# EAGLE design Iridium_9603_Beacon_V5M (EAGLE 9.2.2)

## Sheet 1 of 8
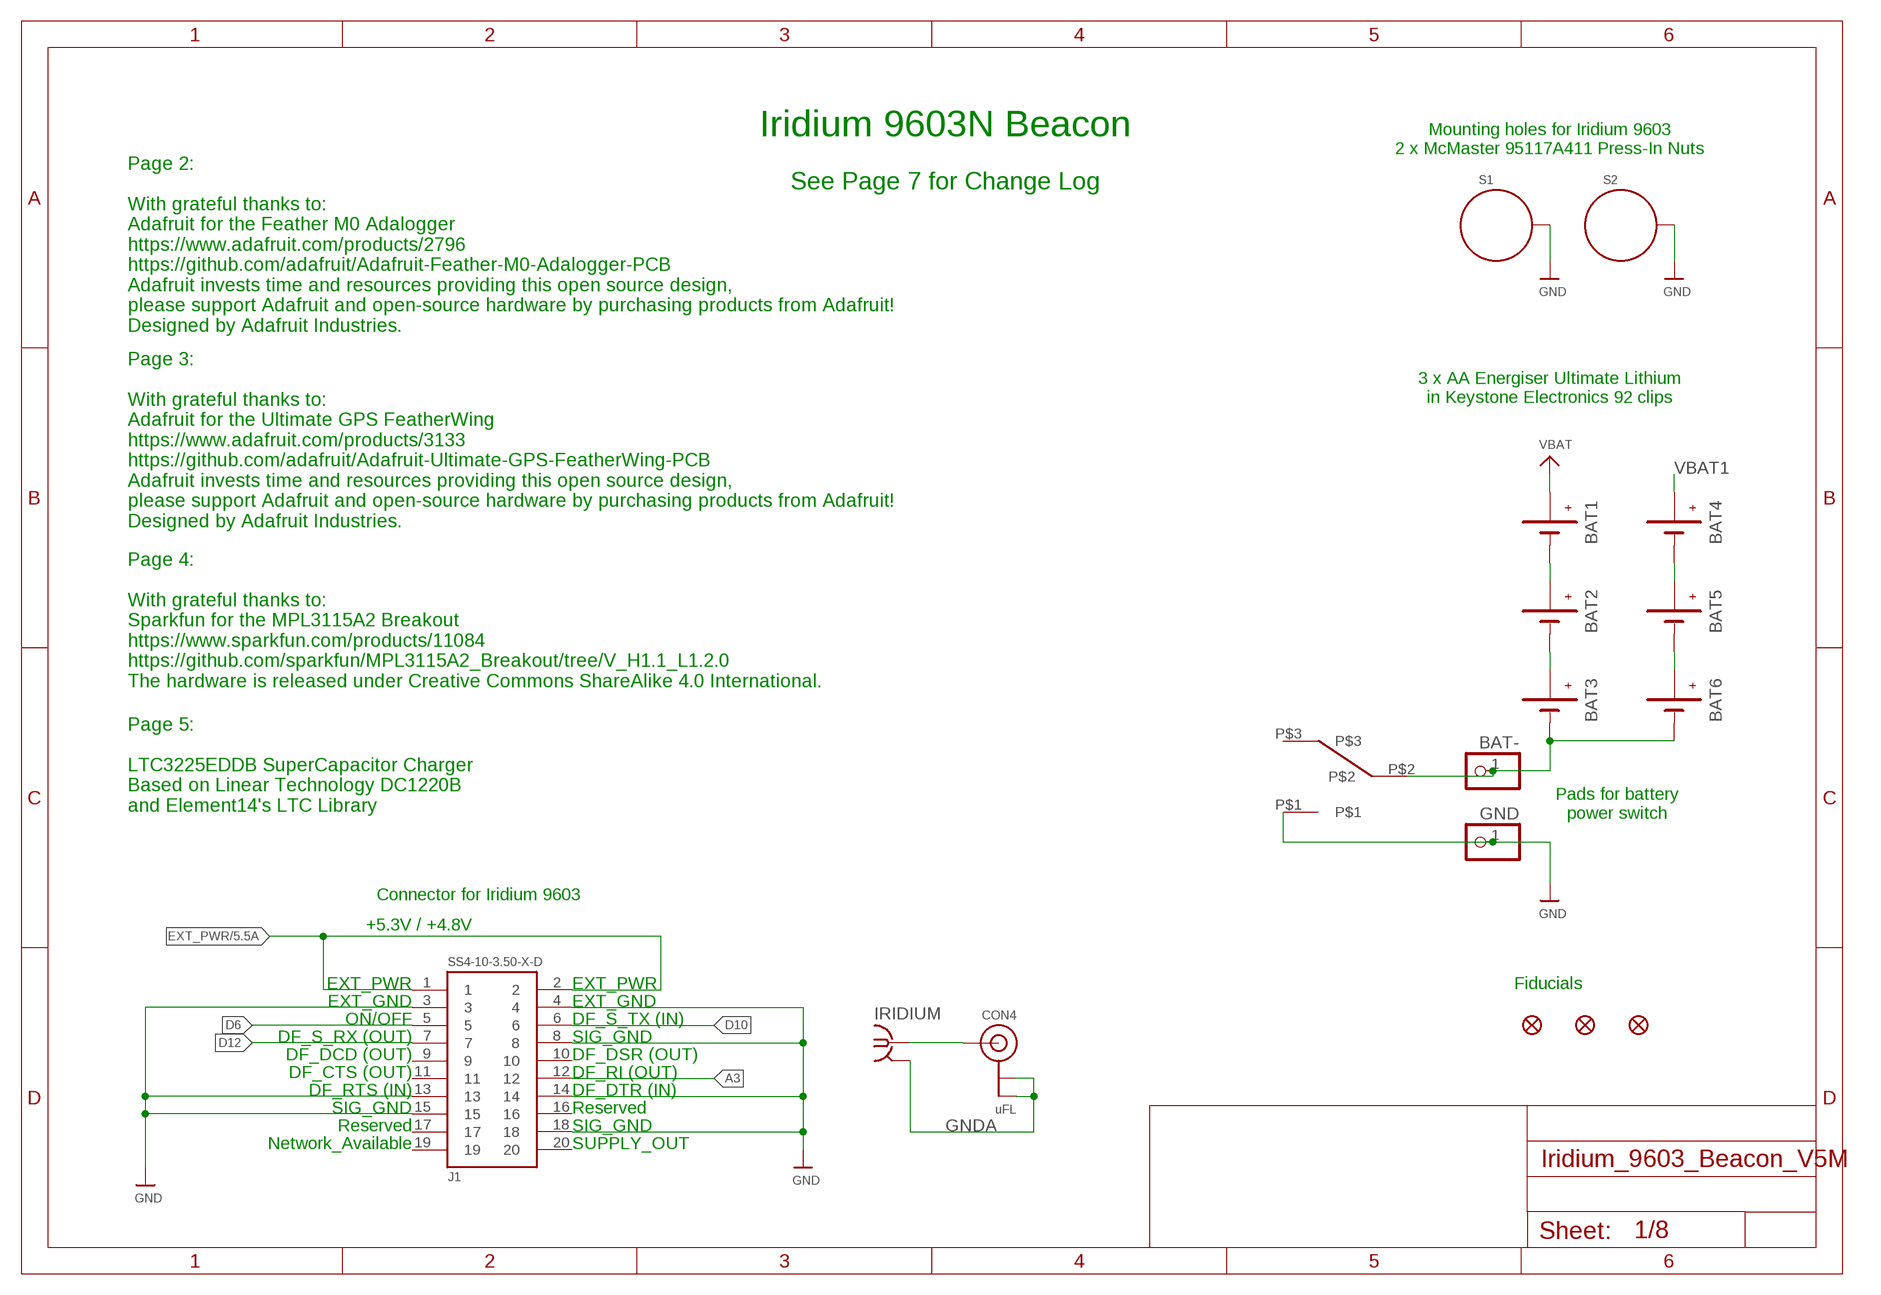
[diagram p0: schematic, sheet 1]

### Parts
BAT1  BATTERYKEYSTONE92  [BATTERY-AAA-KEYSTONE92]
BAT2  BATTERYKEYSTONE92  [BATTERY-AAA-KEYSTONE92]
BAT3  BATTERYKEYSTONE92  [BATTERY-AAA-KEYSTONE92]
BAT4  BATTERYKEYSTONE92  [BATTERY-AAA-KEYSTONE92]
BAT5  BATTERYKEYSTONE92  [BATTERY-AAA-KEYSTONE92]
BAT6  BATTERYKEYSTONE92  [BATTERY-AAA-KEYSTONE92]
BAT-  PINHD-1X1  [1X01]
CON4  uFL  ANTENNA_U.FL  [U.FL]
FD1  FIDUCIAL1X2  [FIDUCIAL-1X2]
FD2  FIDUCIAL1X2  [FIDUCIAL-1X2]
FD3  FIDUCIAL1X2  [FIDUCIAL-1X2]
GND  PINHD-1X1  [1X01]
IRIDIUM  SMA-142-0711-821/826  [J502-ND-142-0711-821/826]
J1  SS4-10-3.50-X-D  [SS4-10-3.50-X-D]
S1  STANDOFF_ELECTRICALMCMASTER-95117A411  [STANDOFF-ELECTRICAL-MCMASTER-95117A411]
S2  STANDOFF_ELECTRICALMCMASTER-95117A411  [STANDOFF-ELECTRICAL-MCMASTER-95117A411]
U53  7101K2AV2QE  [AV2_SPDT]

### Nets
A3: J1.12 ; also sheet 2
D6: J1.5 ; also sheet 2
D10: J1.6 ; also sheet 2
D12: J1.7 ; also sheet 2
EXT_PWR: J1.1 J1.2 ; also sheet 5
GND: GND.1 J1.3 J1.4 J1.8 J1.13 J1.14 J1.15 J1.18 S1.P1 S2.P1 U53.P$1 ; also sheet 2,3,4,5,6
GNDA: CON4.1(GND) CON4.2(GND) IRIDIUM.G@1 IRIDIUM.G@2 IRIDIUM.G@3 IRIDIUM.G@4
N$2: CON4.3(SIGNAL) IRIDIUM.1
N$8: BAT1.GND@1(-) BAT1.GND@2(-) BAT2.PWR@1(+) BAT2.PWR@2(+)
N$15: BAT3.GND@1(-) BAT3.GND@2(-) BAT6.GND@1(-) BAT6.GND@2(-) BAT-.1 U53.P$2
N$21: BAT2.GND@1(-) BAT2.GND@2(-) BAT3.PWR@1(+) BAT3.PWR@2(+)
N$22: BAT4.GND@1(-) BAT4.GND@2(-) BAT5.PWR@1(+) BAT5.PWR@2(+)
N$29: BAT5.GND@1(-) BAT5.GND@2(-) BAT6.PWR@1(+) BAT6.PWR@2(+)
VBAT: BAT1.PWR@1(+) BAT1.PWR@2(+) ; also sheet 2
VBAT1: BAT4.PWR@1(+) BAT4.PWR@2(+) ; also sheet 2
Unconnected: J1.9 J1.10 J1.11 J1.16 J1.17 J1.19 J1.20 U53.P$3

### Notes on the sheet
- Iridium 9603N Beacon
- Mounting holes for Iridium 9603
  2 x McMaster 95117A411 Press-In Nuts
- See Page 7 for Change Log
- Page 2:
  
  With grateful thanks to:
  Adafruit for the Feather M0 Adalogger
  https://www.adafruit.com/products/2796
  https://github.com/adafruit/Adafruit-Feather-M0-Adalogger-PCB
  Adafruit invests time and resources providing this open source design,
  please support Adafruit and open-source hardware by purchasing products from Adafruit!
  Designed by Adafruit Industries.
- 3 x AA Energiser Ultimate Lithium
  in Keystone Electronics 92 clips
- Page 3:
  
  With grateful thanks to:
  Adafruit for the Ultimate GPS FeatherWing
  https://www.adafruit.com/products/3133
  https://github.com/adafruit/Adafruit-Ultimate-GPS-FeatherWing-PCB
  Adafruit invests time and resources providing this open source design,
  please support Adafruit and open-source hardware by purchasing products from Adafruit!
  Designed by Adafruit Industries.
- Page 4:
  
  With grateful thanks to:
  Sparkfun for the MPL3115A2 Breakout
  https://www.sparkfun.com/products/11084
  https://github.com/sparkfun/MPL3115A2_Breakout/tree/V_H1.1_L1.2.0
  The hardware is released under Creative Commons ShareAlike 4.0 International.
- Page 5:
  
  LTC3225EDDB SuperCapacitor Charger
  Based on Linear Technology DC1220B
  and Element14's LTC Library
- Pads for battery
  power switch
- Connector for Iridium 9603
- +5.3V / +4.8V
- EXT_PWR | EXT_PWR | Fiducials
- EXT_GND | EXT_GND
- ON/OFF | DF_S_TX (IN)
- DF_S_RX (OUT) | SIG_GND
- DF_DCD (OUT) | DF_DSR (OUT)
- DF_CTS (OUT) | DF_RI (OUT)
- DF_RTS (IN) | DF_DTR (IN)
- SIG_GND | Reserved
- Reserved | SIG_GND
- Network_Available | SUPPLY_OUT

## Sheet 2 of 8
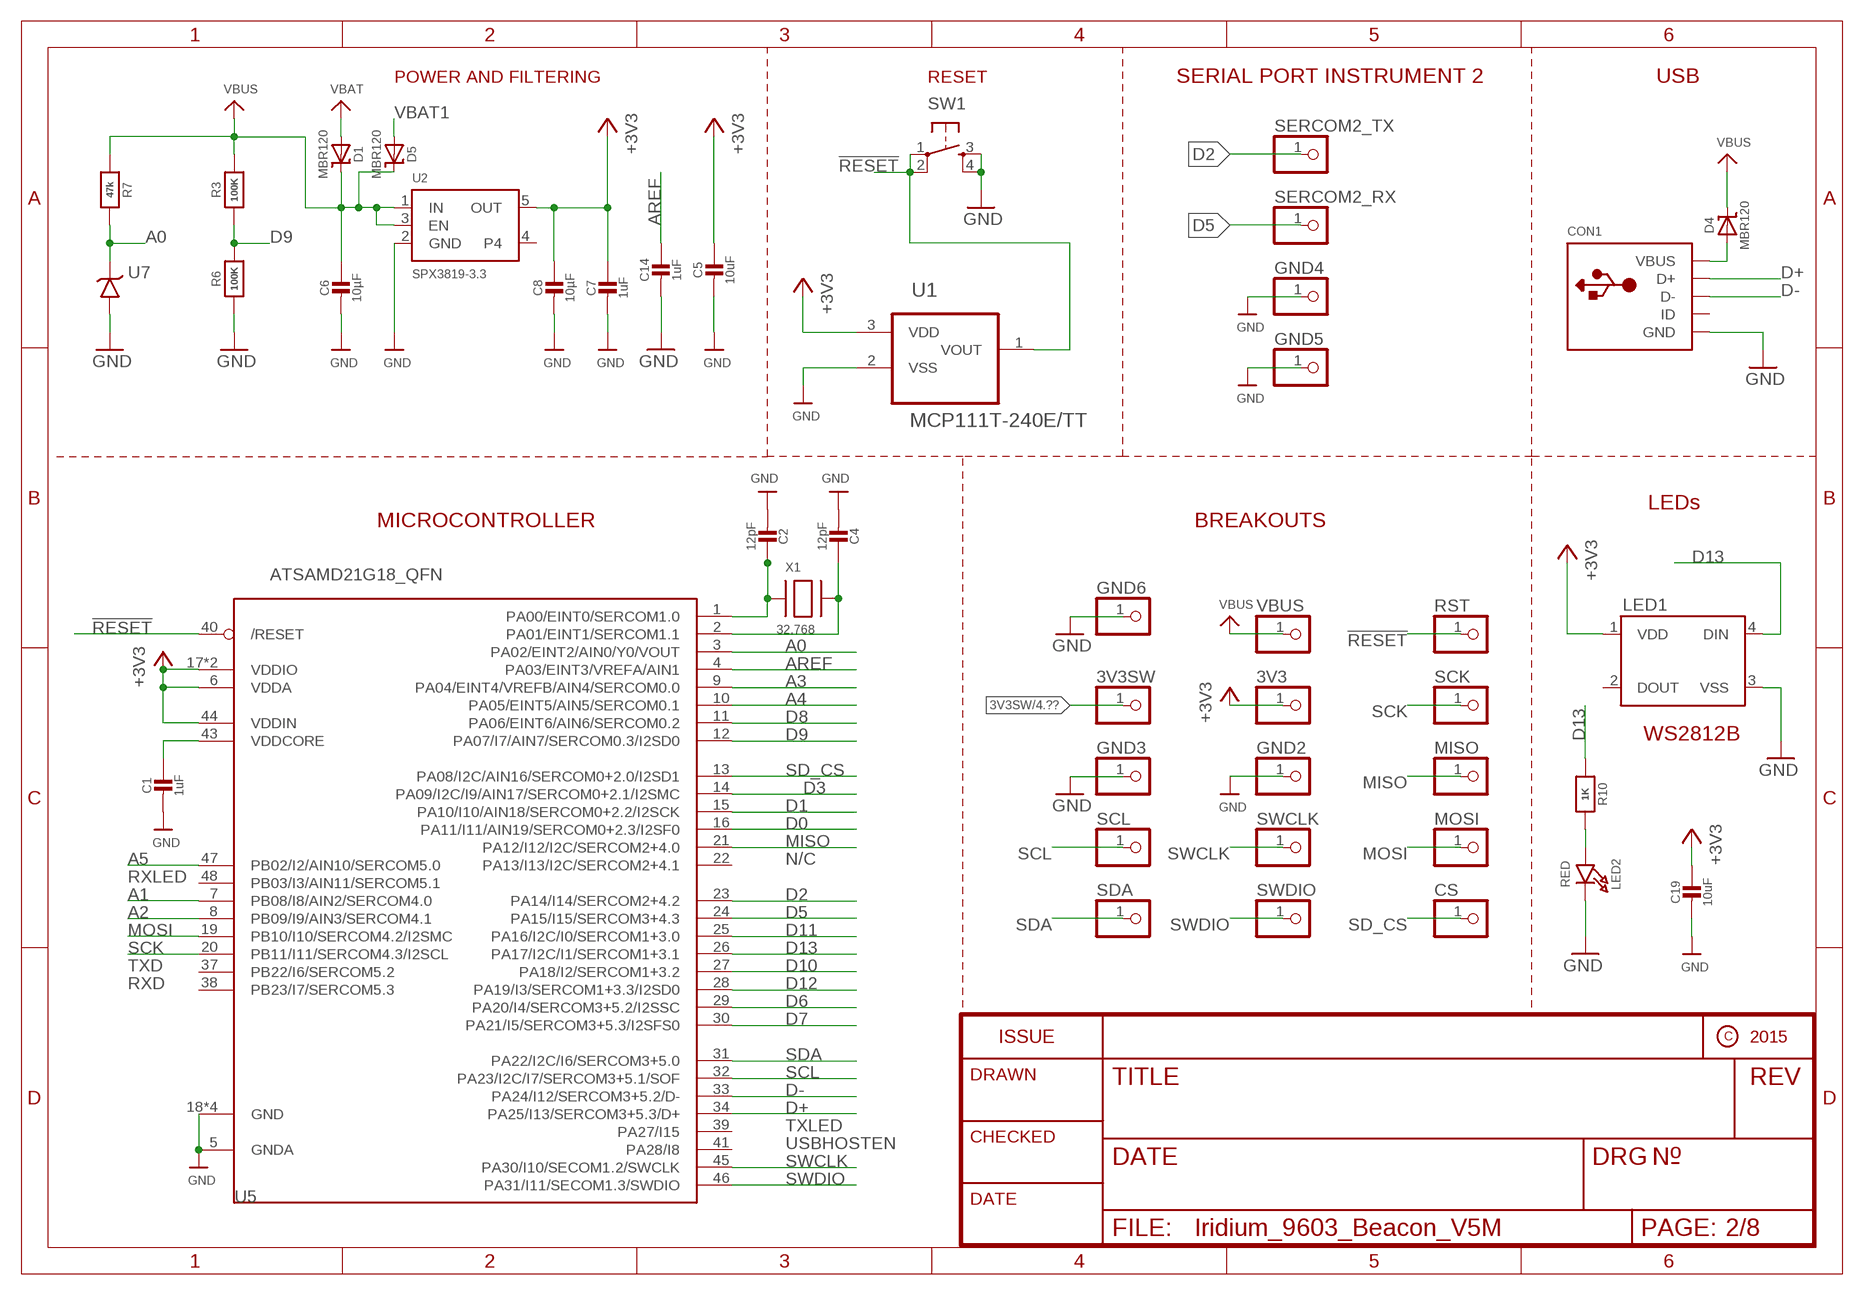
[diagram p1: schematic, sheet 2]

### Parts
3V3  PINHD-1X1  [1X01]
3V3SW  PINHD-1X1  [1X01]
C1  1uF  CAP_CERAMIC0603_NO  [0603-NO]
C2  12pF  CAP_CERAMIC0603_NO  [0603-NO]
C4  12pF  CAP_CERAMIC0603_NO  [0603-NO]
C5  10uF  CAP_CERAMIC0805-NOOUTLINE  [0805-NO]
C6  10µF  CAP_CERAMIC0805-NOOUTLINE  [0805-NO]
C7  1uF  CAP_CERAMIC0603_NO  [0603-NO]
C8  10µF  CAP_CERAMIC0805-NOOUTLINE  [0805-NO]
C14  1uF  CAP_CERAMIC0603_NO  [0603-NO]
C19  10uF  CAP_CERAMIC0805-NOOUTLINE  [0805-NO]
CON1  USBFCI_10103594  [FCI_10103594]
CS  PINHD-1X1  [1X01]
D1  MBR120  DIODE-SCHOTTKYSOD-123  [SOD-123]
D4  MBR120  DIODE-SCHOTTKYSOD-123  [SOD-123]
D5  MBR120  DIODE-SCHOTTKYSOD-123  [SOD-123]
GND2  PINHD-1X1  [1X01]
GND3  PINHD-1X1  [1X01]
GND4  PINHD-1X1  [1X01]
GND5  PINHD-1X1  [1X01]
GND6  PINHD-1X1  [1X01]
LED1  WS2812B  [WS2812B]
LED2  RED  LED0805_NOOUTLINE  [CHIPLED_0805_NOOUTLINE]
MISO  PINHD-1X1  [1X01]
MOSI  PINHD-1X1  [1X01]
R3  100K  RESISTOR0805_NOOUTLINE  [0805-NO]
R6  100K  RESISTOR0805_NOOUTLINE  [0805-NO]
R7  47k  RESISTOR_0603_NOOUT  [0603-NO]
R10  1K  RESISTOR_0603_NOOUT  [0603-NO]
RST  PINHD-1X1  [1X01]
SCK  PINHD-1X1  [1X01]
SCL  PINHD-1X1  [1X01]
SDA  PINHD-1X1  [1X01]
SERCOM2_RX  PINHD-1X1  [1X01]
SERCOM2_TX  PINHD-1X1  [1X01]
SW1  SWITCH_SPST_4_PINRECT  [TACTILE_SWITCH_SMD_4.6X2.8MM]
SWCLK  PINHD-1X1  [1X01]
SWDIO  PINHD-1X1  [1X01]
U1  MCP111T-240E/TT  MCP111T-270E/TT  [SOT95P237X112-3N]
U2  SPX3819-3.3  VREG_SOT23-5  [SOT23-5]
U5  ATSAMD21G18_QFN  ATSAMD21J_QFN  [TQFN48_7MM]
U7  LT1634-1,25BMCMS8  [MSOP8]
VBUS  PINHD-1X1  [1X01]
X1  32.768  XTAL-3.2X1.5  [XTAL3215]

### Nets
3V3SW: 3V3SW.1 ; also sheet 3,4
!RESET: RST.1 SW1.1 SW1.2 U1.1(VOUT) U5.40(/RESET)
+3V3: 3V3.1 C5.1 C7.1 C8.1 C19.1 LED1.1(VDD) U1.3(VDD) U2.5(OUT) U5.6(VDDA) U5.17(VDDIO) U5.36(VDDIO) U5.44(VDDIN) ; also sheet 3,4,5,6
A0: R7.2 U5.3(PA02/EINT2/AIN0/Y0/VOUT) U7.6(VOUT)
A1: U5.7(PB08/I8/AIN2/SERCOM4.0) ; also sheet 5
A2: U5.8(PB09/I9/AIN3/SERCOM4.1)
A3: U5.9(PA04/EINT4/VREFB/AIN4/SERCOM0.0) ; also sheet 1
A4: U5.10(PA05/EINT5/AIN5/SERCOM0.1)
A5: U5.47(PB02/I2/AIN10/SERCOM5.0) ; also sheet 5
AREF: C14.1 U5.4(PA03/EINT3/VREFA/AIN1)
D0: U5.16(PA11/I11/AIN19/SERCOM0+2.3/I2SF0) ; also sheet 3
D1: U5.15(PA10/I10/AIN18/SERCOM0+2.2/I2SCK) ; also sheet 3
D2: SERCOM2_TX.1 U5.23(PA14/I14/SERCOM2+4.2)
D3: U5.14(PA09/I2C/I9/AIN17/SERCOM0+2.1/I2SMC) ; also sheet 6
D5: SERCOM2_RX.1 U5.24(PA15/I15/SERCOM3+4.3)
D6: U5.29(PA20/I4/SERCOM3+5.2/I2SSC) ; also sheet 1
D7: U5.30(PA21/I5/SERCOM3+5.3/I2SFS0) ; also sheet 6
D8: U5.11(PA06/EINT6/AIN6/SERCOM0.2) ; also sheet 5
D9: R3.1 R6.2 U5.12(PA07/I7/AIN7/SERCOM0.3/I2SD0)
D10: U5.27(PA18/I2/SERCOM1+3.2) ; also sheet 1
D11: U5.25(PA16/I2C/I0/SERCOM1+3.0) ; also sheet 3
D12: U5.28(PA19/I3/SERCOM1+3.3/I2SD0) ; also sheet 1
D13: LED1.4(DIN) R10.1 U5.26(PA17/I2C/I1/SERCOM1+3.1)
D+: CON1.D+ U5.34(PA25/I13/SERCOM3+5.3/D+)
D-: CON1.D- U5.33(PA24/I12/SERCOM3+5.2/D-)
GND: C1.2 C2.2 C4.2 C5.2 C6.2 C7.2 C8.2 C14.2 C19.2 CON1.BASE@1(GND) CON1.BASE@2(GND) CON1.GND CON1.SPRT@1(GND) CON1.SPRT@2(GND) CON1.SPRT@3(GND) CON1.SPRT@4(GND) GND2.1 GND3.1 GND4.1 GND5.1 GND6.1 LED1.3(VSS) LED2.C R6.1 SW1.3 SW1.4 U1.2(VSS) U2.2(GND) U5.5(GNDA) U5.18(GND) U5.35(GND) U5.42(GND) U5.THERMAL(GND) U7.4(GND) ; also sheet 1,3,4,5,6
MISO: MISO.1 U5.21(PA12/I12/I2C/SERCOM2+4.0)
MOSI: MOSI.1 U5.19(PB10/I10/SERCOM4.2/I2SMC)
N$3: LED2.A R10.2
N$5: C2.1 U5.1(PA00/EINT0/SERCOM1.0) X1.P$1
N$7: C4.1 U5.2(PA01/EINT1/SERCOM1.1) X1.P$2
N$16: CON1.VBUS D4.A
SCK: SCK.1 U5.20(PB11/I11/SERCOM4.3/I2SCL)
SCL: SCL.1 U5.32(PA23/I2C/I7/SERCOM3+5.1/SOF) ; also sheet 4
SD_CS: CS.1 U5.13(PA08/I2C/AIN16/SERCOM0+2.0/I2SD1)
SDA: SDA.1 U5.31(PA22/I2C/I6/SERCOM3+5.0) ; also sheet 4
SWCLK: SWCLK.1 U5.45(PA30/I10/SECOM1.2/SWCLK)
SWDIO: SWDIO.1 U5.46(PA31/I11/SECOM1.3/SWDIO)
VBAT: D1.A ; also sheet 1
VBAT1: D5.A ; also sheet 1
VBUS: C6.1 D1.C D4.C D5.C R3.2 R7.1 U2.1(IN) U2.3(EN) VBUS.1 ; also sheet 5
VDDCORE1: C1.1 U5.43(VDDCORE)
Unconnected: CON1.ID LED1.2(DOUT) U2.4 U5.22(PA13/I13/I2C/SERCOM2+4.1) U5.37(PB22/I6/SERCOM5.2) U5.38(PB23/I7/SERCOM5.3) U5.39(PA27/I15) U5.41(PA28/I8) U5.48(PB03/I3/AIN11/SERCOM5.1)

### Notes on the sheet
- POWER AND FILTERING | RESET | SERIAL PORT INSTRUMENT 2 | USB
- LEDs
- MICROCONTROLLER | BREAKOUTS
- WS2812B
- N/C
- RXLED
- TXD
- RXD
- TXLED
- USBHOSTEN

## Sheet 3 of 8
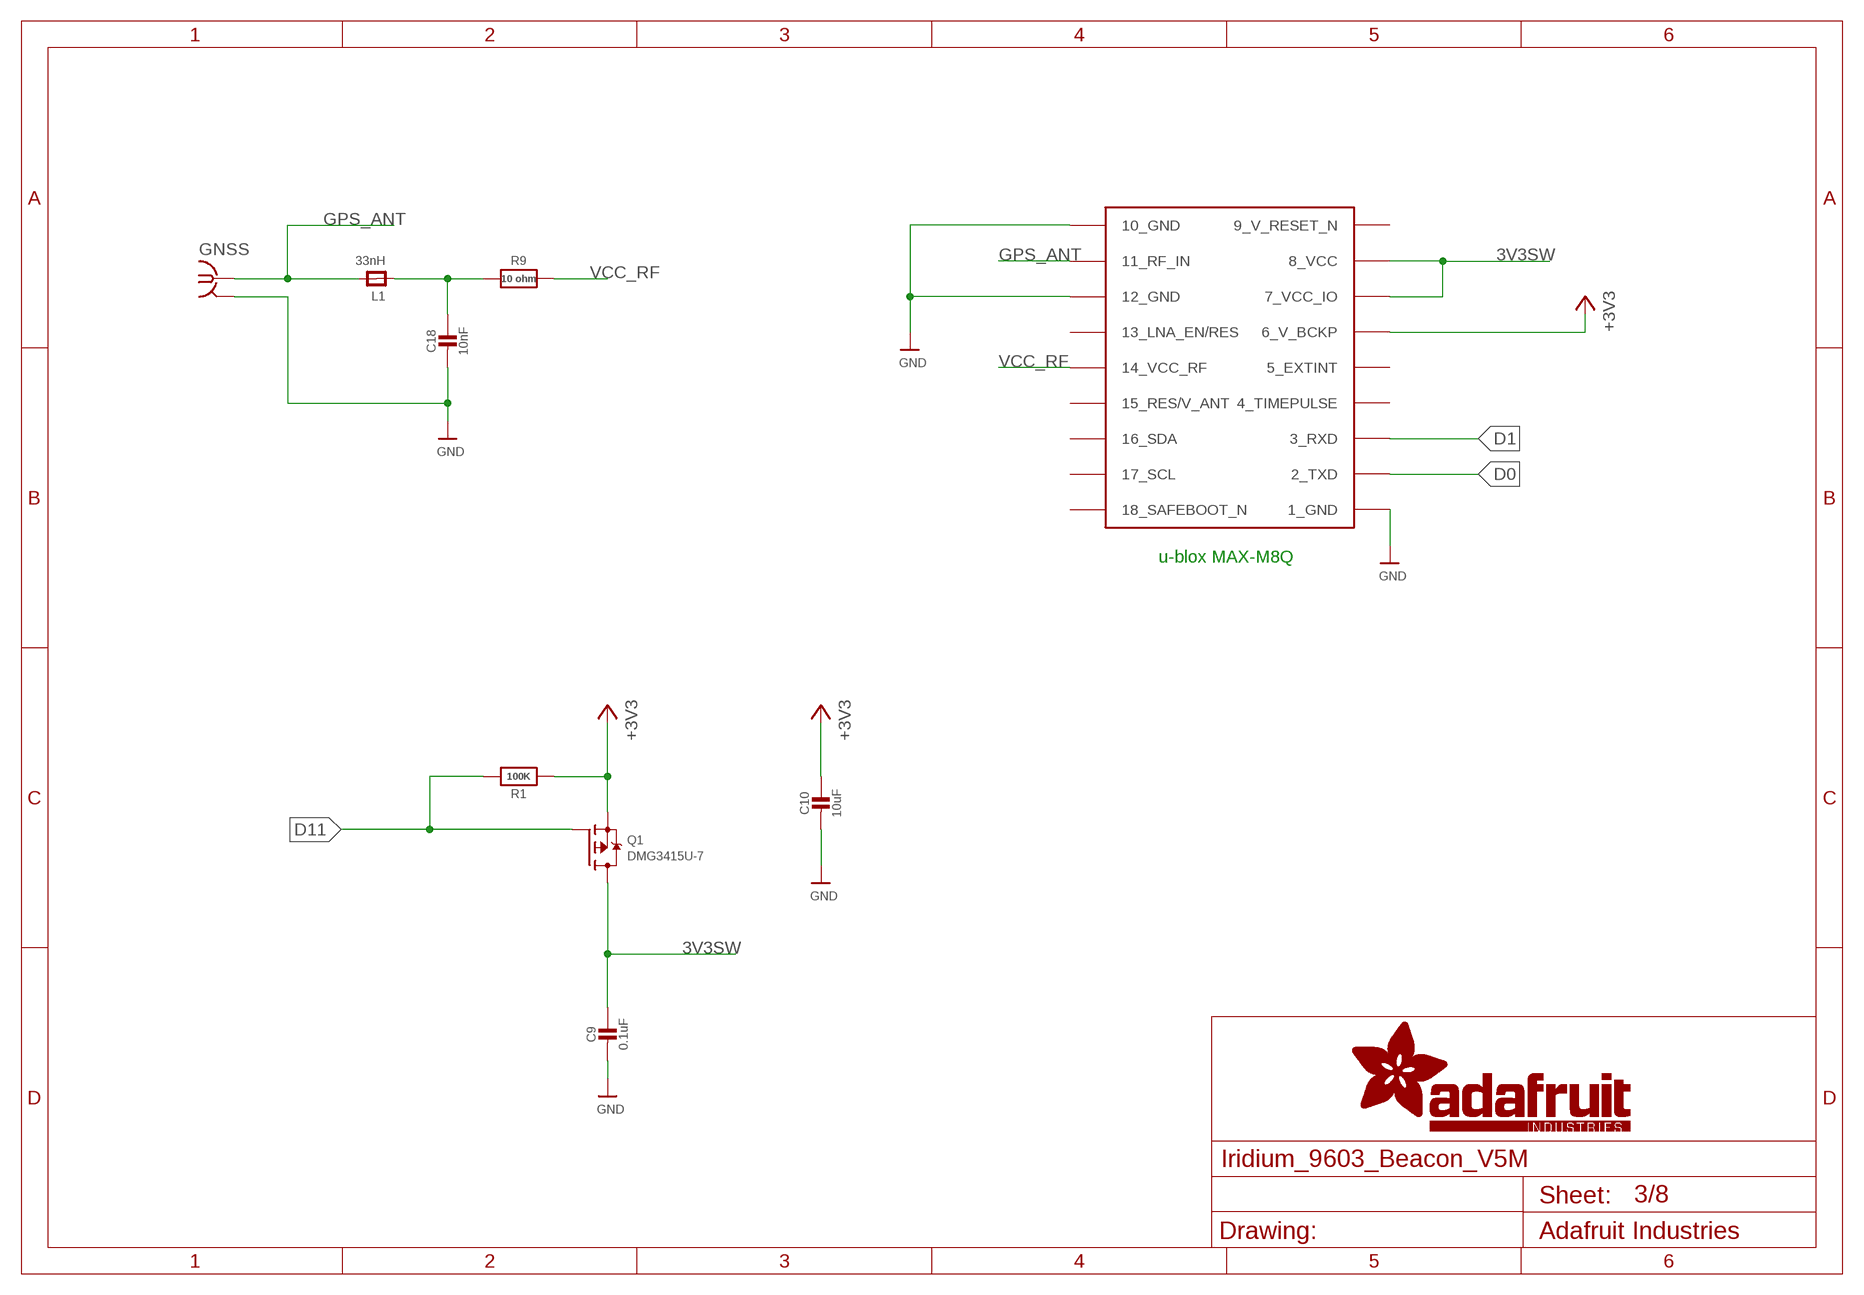
[diagram p2: schematic, sheet 3]

### Parts
C9  0.1uF  CAP_CERAMIC0805-NOOUTLINE  [0805-NO]
C10  10uF  CAP_CERAMIC0805-NOOUTLINE  [0805-NO]
C18  10nF  CAP_CERAMIC0805-NOOUTLINE  [0805-NO]
GNSS  SMA-142-0711-821/826  [J502-ND-142-0711-821/826]
L1  33nH  FERRITE-0805NO  [0805-NO]
Q1  DMG3415U-7  MOSFET-PWIDE  [SOT23-WIDE]
R1  100K  RESISTOR0805_NOOUTLINE  [0805-NO]
R9  10 ohm  RESISTOR0805_NOOUTLINE  [0805-NO]
U6  MAX-M8  [MAX-M8]

### Nets
3V3SW: C9.1 Q1.3(D) U6.7_VCC_IO U6.8_VCC ; also sheet 2,4
+3V3: C10.1 Q1.2(S) R1.1 U6.6_V_BCKP ; also sheet 2,4,5,6
D0: U6.2_TXD ; also sheet 2
D1: U6.3_RXD ; also sheet 2
D11: Q1.1(G) R1.2 ; also sheet 2
GND: C9.2 C10.2 C18.2 GNSS.G@1 GNSS.G@2 GNSS.G@3 GNSS.G@4 U6.1_GND U6.10_GND U6.12_GND ; also sheet 1,2,4,5,6
GPS_ANT: GNSS.1 L1.2 U6.11_RF_IN
N$1: C18.1 L1.1 R9.1
VCC_RF: R9.2 U6.14_VCC_RF
Unconnected: U6.4_TIMEPULSE U6.5_EXTINT U6.13_LNA_EN(13_LNA_EN/RES) U6.15_V_ANT/RESERVED(15_RES/V_ANT) U6.16_SDA U6.17_SCL U6.18_SAFEBOOT_N

### Notes on the sheet
- u-blox MAX-M8Q

## Sheet 4 of 8
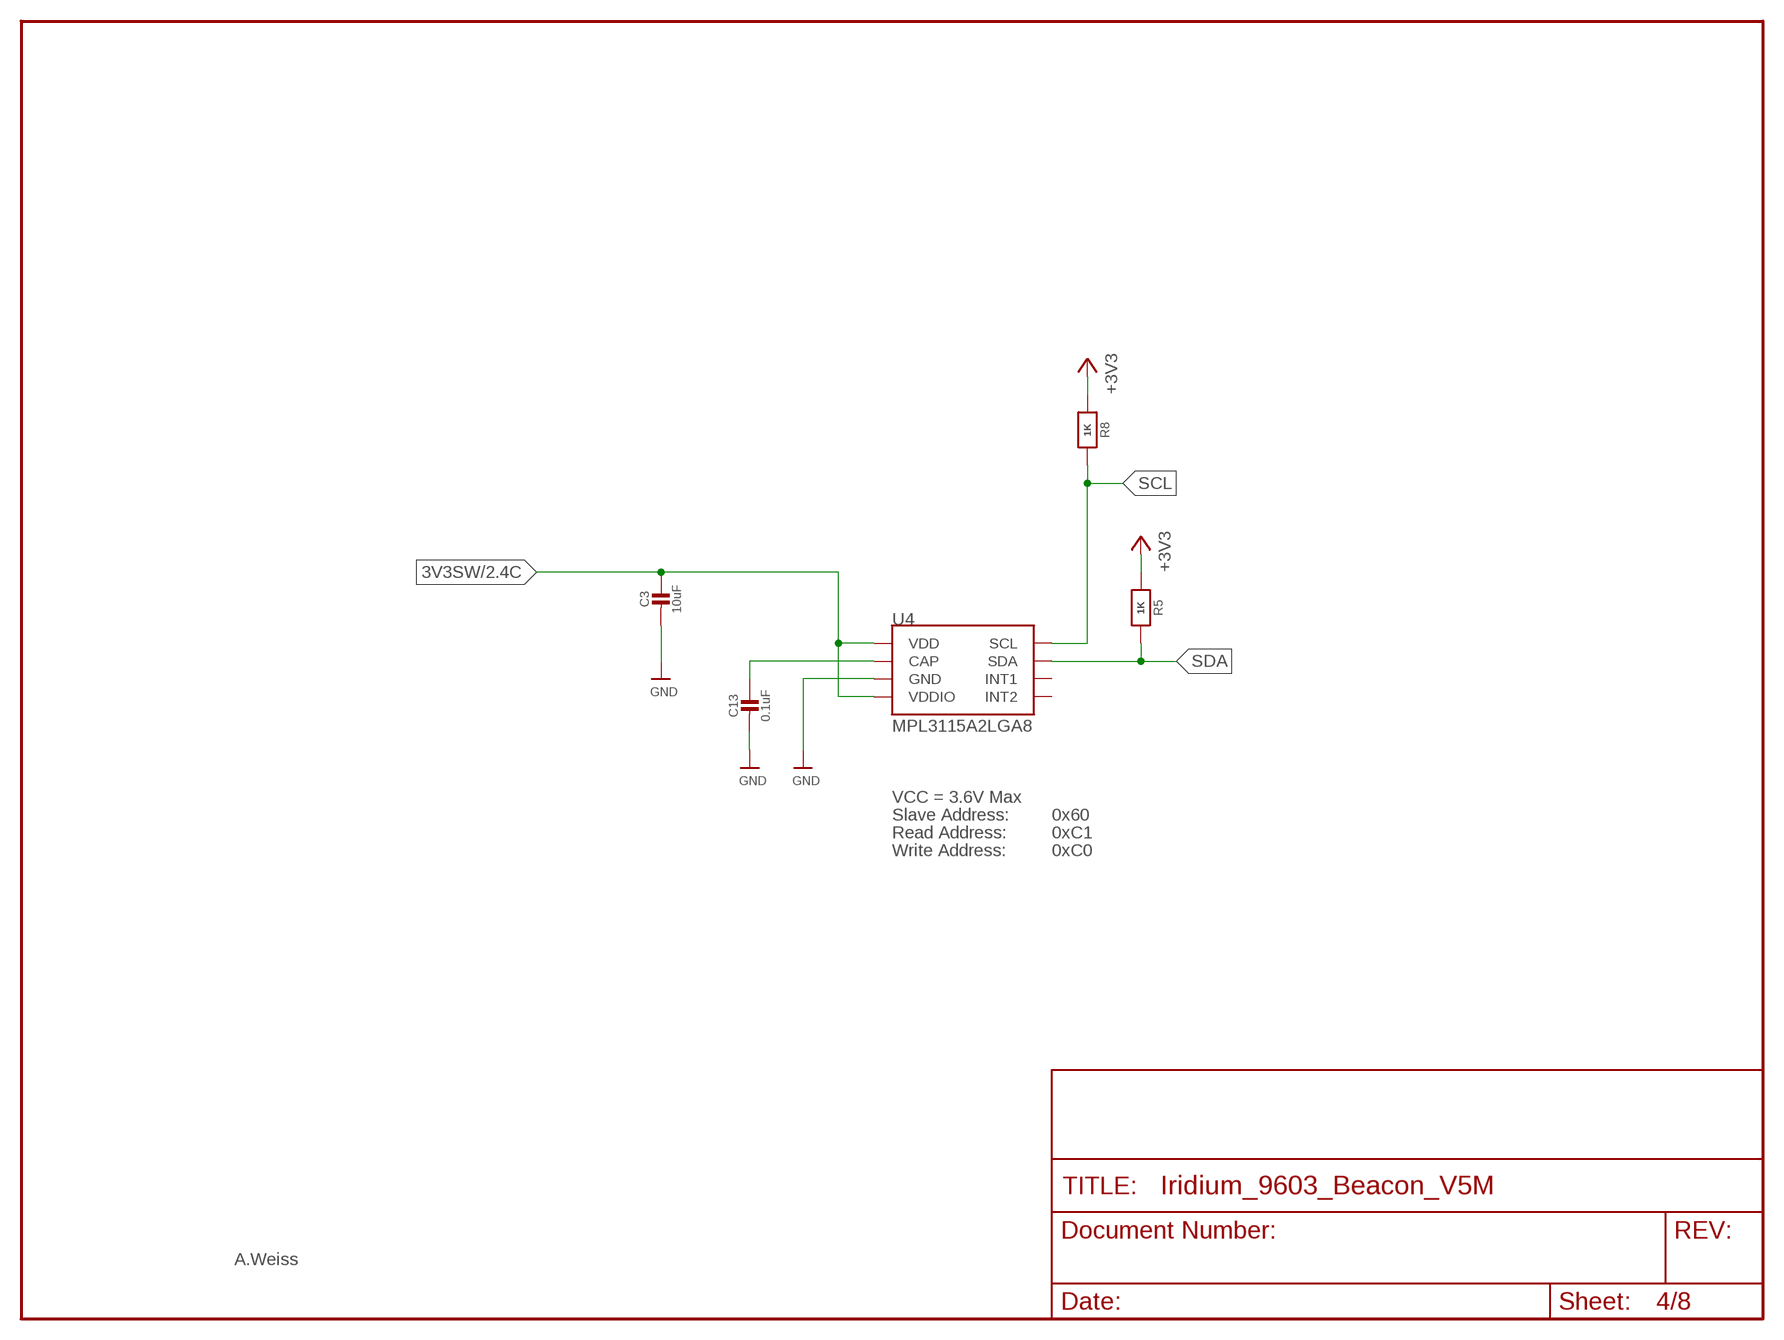
[diagram p3: schematic, sheet 4]

### Parts
C3  10uF  CAP_CERAMIC0805-NOOUTLINE  [0805-NO]
C13  0.1uF  CAP_CERAMIC0805-NOOUTLINE  [0805-NO]
R5  1K  RESISTOR_0603_NOOUT  [0603-NO]
R8  1K  RESISTOR_0603_NOOUT  [0603-NO]
U4  MPL3115A2LGA8  [LGA8]

### Nets
3V3SW: C3.1 U4.1(VDD) U4.4(VDDIO) ; also sheet 2,3
+3V3: R5.1 R8.1 ; also sheet 2,3,5,6
GND: C3.2 C13.2 U4.3(GND) ; also sheet 1,2,3,5,6
N$12: C13.1 U4.2(CAP)
SCL: R8.2 U4.8(SCL) ; also sheet 2
SDA: R5.2 U4.7(SDA) ; also sheet 2
Unconnected: U4.5(INT2) U4.6(INT1)

### Notes on the sheet
- VCC = 3.6V Max
- Slave Address: | 0x60
- Read Address: | 0xC1
- Write Address: | 0xC0
- A.Weiss

## Sheet 5 of 8
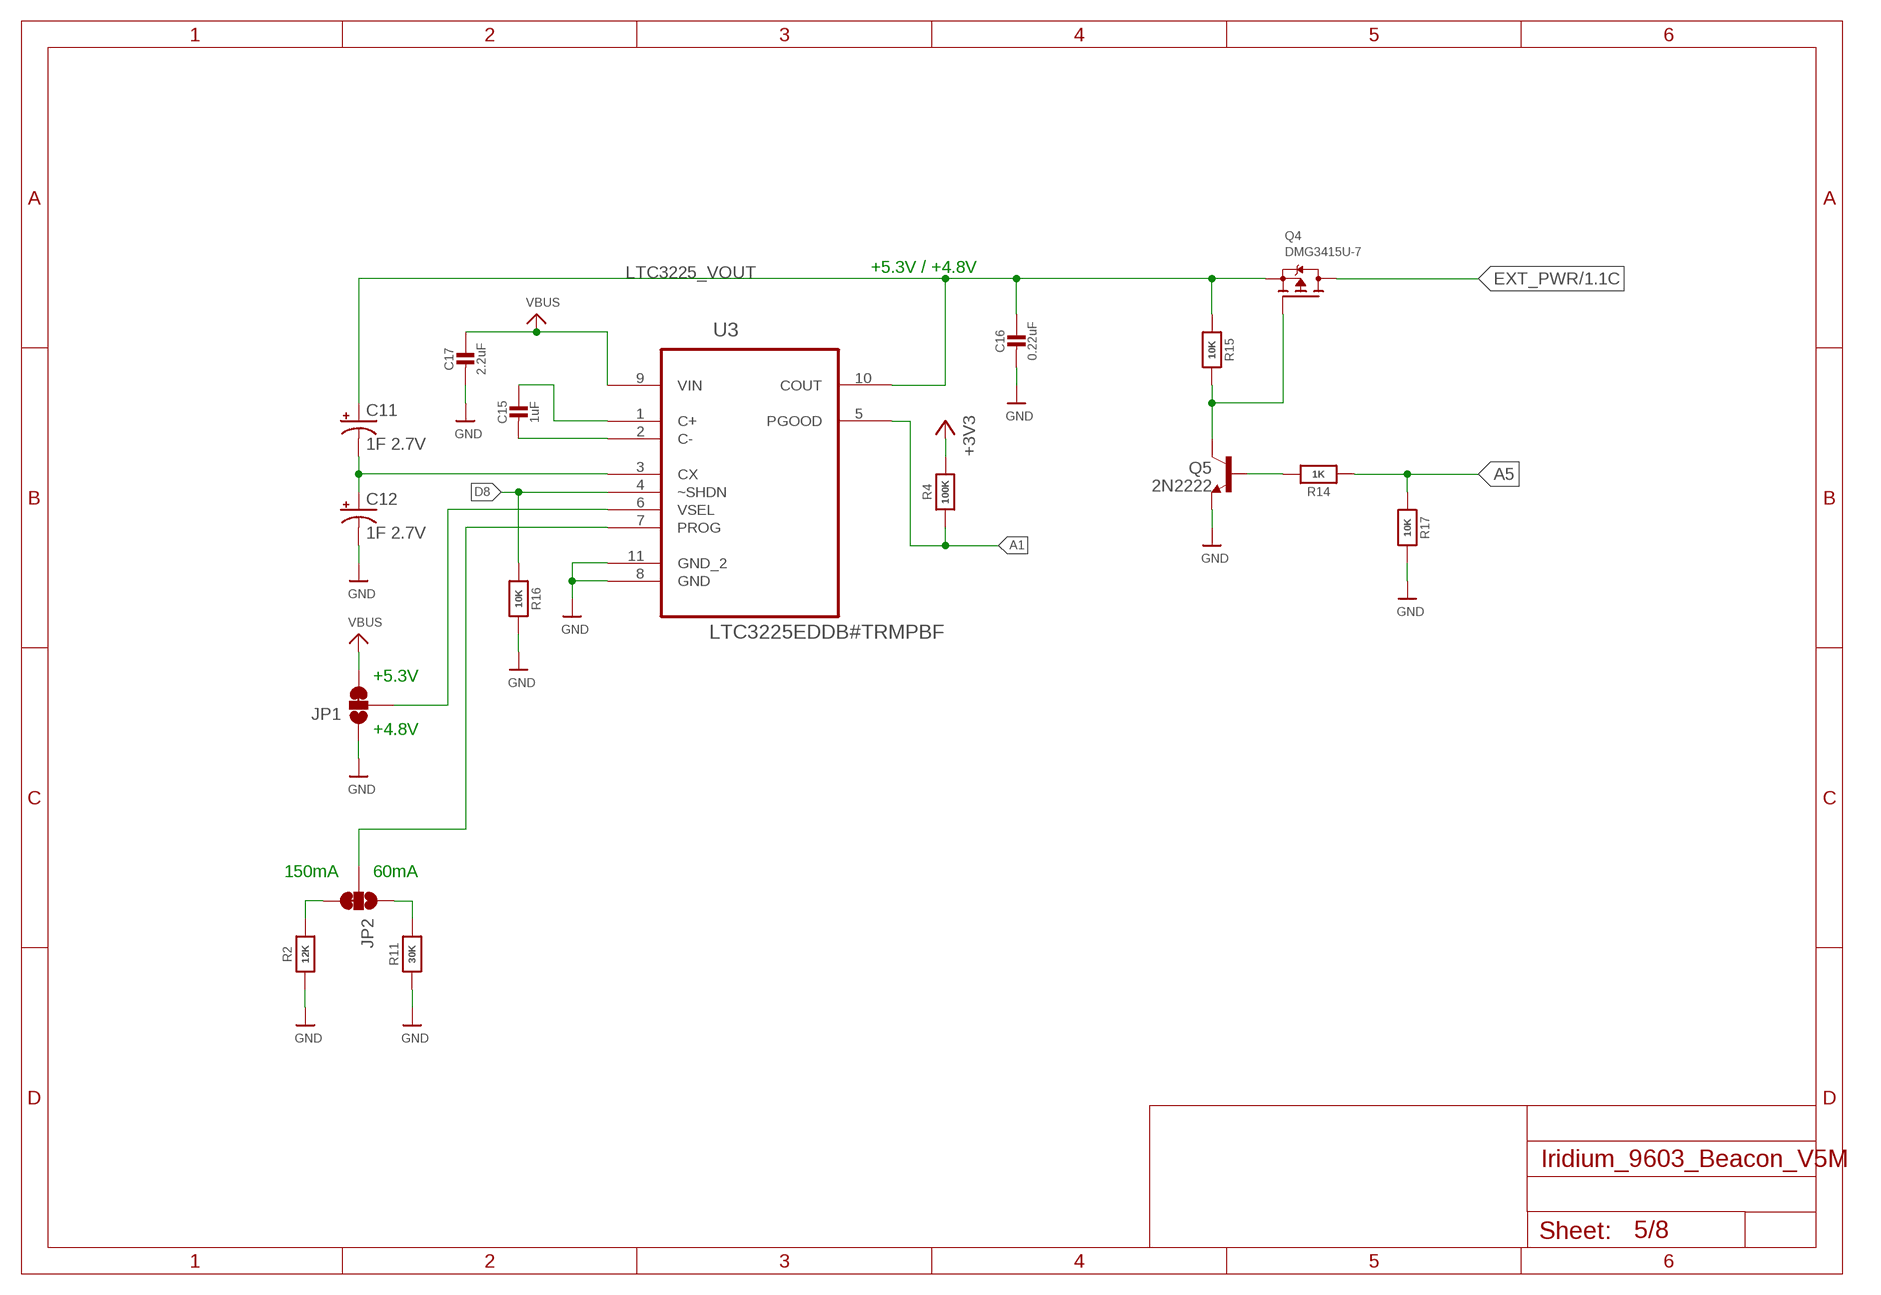
[diagram p4: schematic, sheet 5]

### Parts
C11  1F 2.7V  1F-2.7V(PTH)CPOL-RADIAL-1H-2.7V  [CPOL-RADIAL-1F-2.7V]
C12  1F 2.7V  1F-2.7V(PTH)CPOL-RADIAL-1H-2.7V  [CPOL-RADIAL-1F-2.7V]
C15  1uF  CAP_CERAMIC0603_NO  [0603-NO]
C16  0.22uF  CAP_CERAMIC0603_NO  [0603-NO]
C17  2.2uF  CAP_CERAMIC0805-NOOUTLINE  [0805-NO]
JP1  JUMPER-PAD-3-2OF3_NC_BY_TRACE_LARGE  [PAD-JUMPER-3-2OF3_NC_BY_TRACE_YES_SILK_LARGE]
JP2  JUMPER-PAD-3-2OF3_NC_BY_TRACE_LARGE  [PAD-JUMPER-3-2OF3_NC_BY_TRACE_YES_SILK_LARGE]
Q4  DMG3415U-7  MOSFET-PWIDE  [SOT23-WIDE]
Q5  2N2222  MMBT2222ALT1-NPN-SOT23-BEC  [SOT23-BEC]
R2  12K  RESISTOR0805_NOOUTLINE  [0805-NO]
R4  100K  RESISTOR0805_NOOUTLINE  [0805-NO]
R11  30K  RESISTOR0805_NOOUTLINE  [0805-NO]
R14  1K  RESISTOR_0603_NOOUT  [0603-NO]
R15  10K  RESISTOR_0603_NOOUT  [0603-NO]
R16  10K  RESISTOR_0603_NOOUT  [0603-NO]
R17  10K  RESISTOR_0603_NOOUT  [0603-NO]
U3  LTC3225EDDB#TRMPBF  LTC3225EDDB-TRMPBFDFN300X200-10L  [DFN300X200-10L]

### Nets
+3V3: R4.2 ; also sheet 2,3,4,6
A1: R4.1 U3.5(PGOOD) ; also sheet 2
A5: R14.1 R17.1 ; also sheet 2
D8: R16.1 U3.4(~SHDN) ; also sheet 2
EXT_PWR: Q4.3(D) ; also sheet 1
GND: C12.- C16.2 C17.2 JP1.1 Q5.E R2.1 R11.1 R16.2 R17.2 U3.8(GND) U3.11(GND_2) ; also sheet 1,2,3,4,6
LTC3225_VOUT: C11.+ C16.1 Q4.2(S) R15.1 U3.10(COUT)
N$6: C11.- C12.+ U3.3(CX)
N$9: C15.2 U3.2(C-)
N$10: C15.1 U3.1(C+)
N$11: JP2.2 U3.7(PROG)
N$13: JP1.2 U3.6(VSEL)
N$17: JP2.3 R2.2
N$18: JP2.1 R11.2
N$19: Q4.1(G) Q5.C R15.2
N$20: Q5.B R14.2
VBUS: C17.1 JP1.3 U3.9(VIN) ; also sheet 2

### Notes on the sheet
- +5.3V / +4.8V
- +5.3V
- +4.8V
- 150mA | 60mA

## Sheet 6 of 8
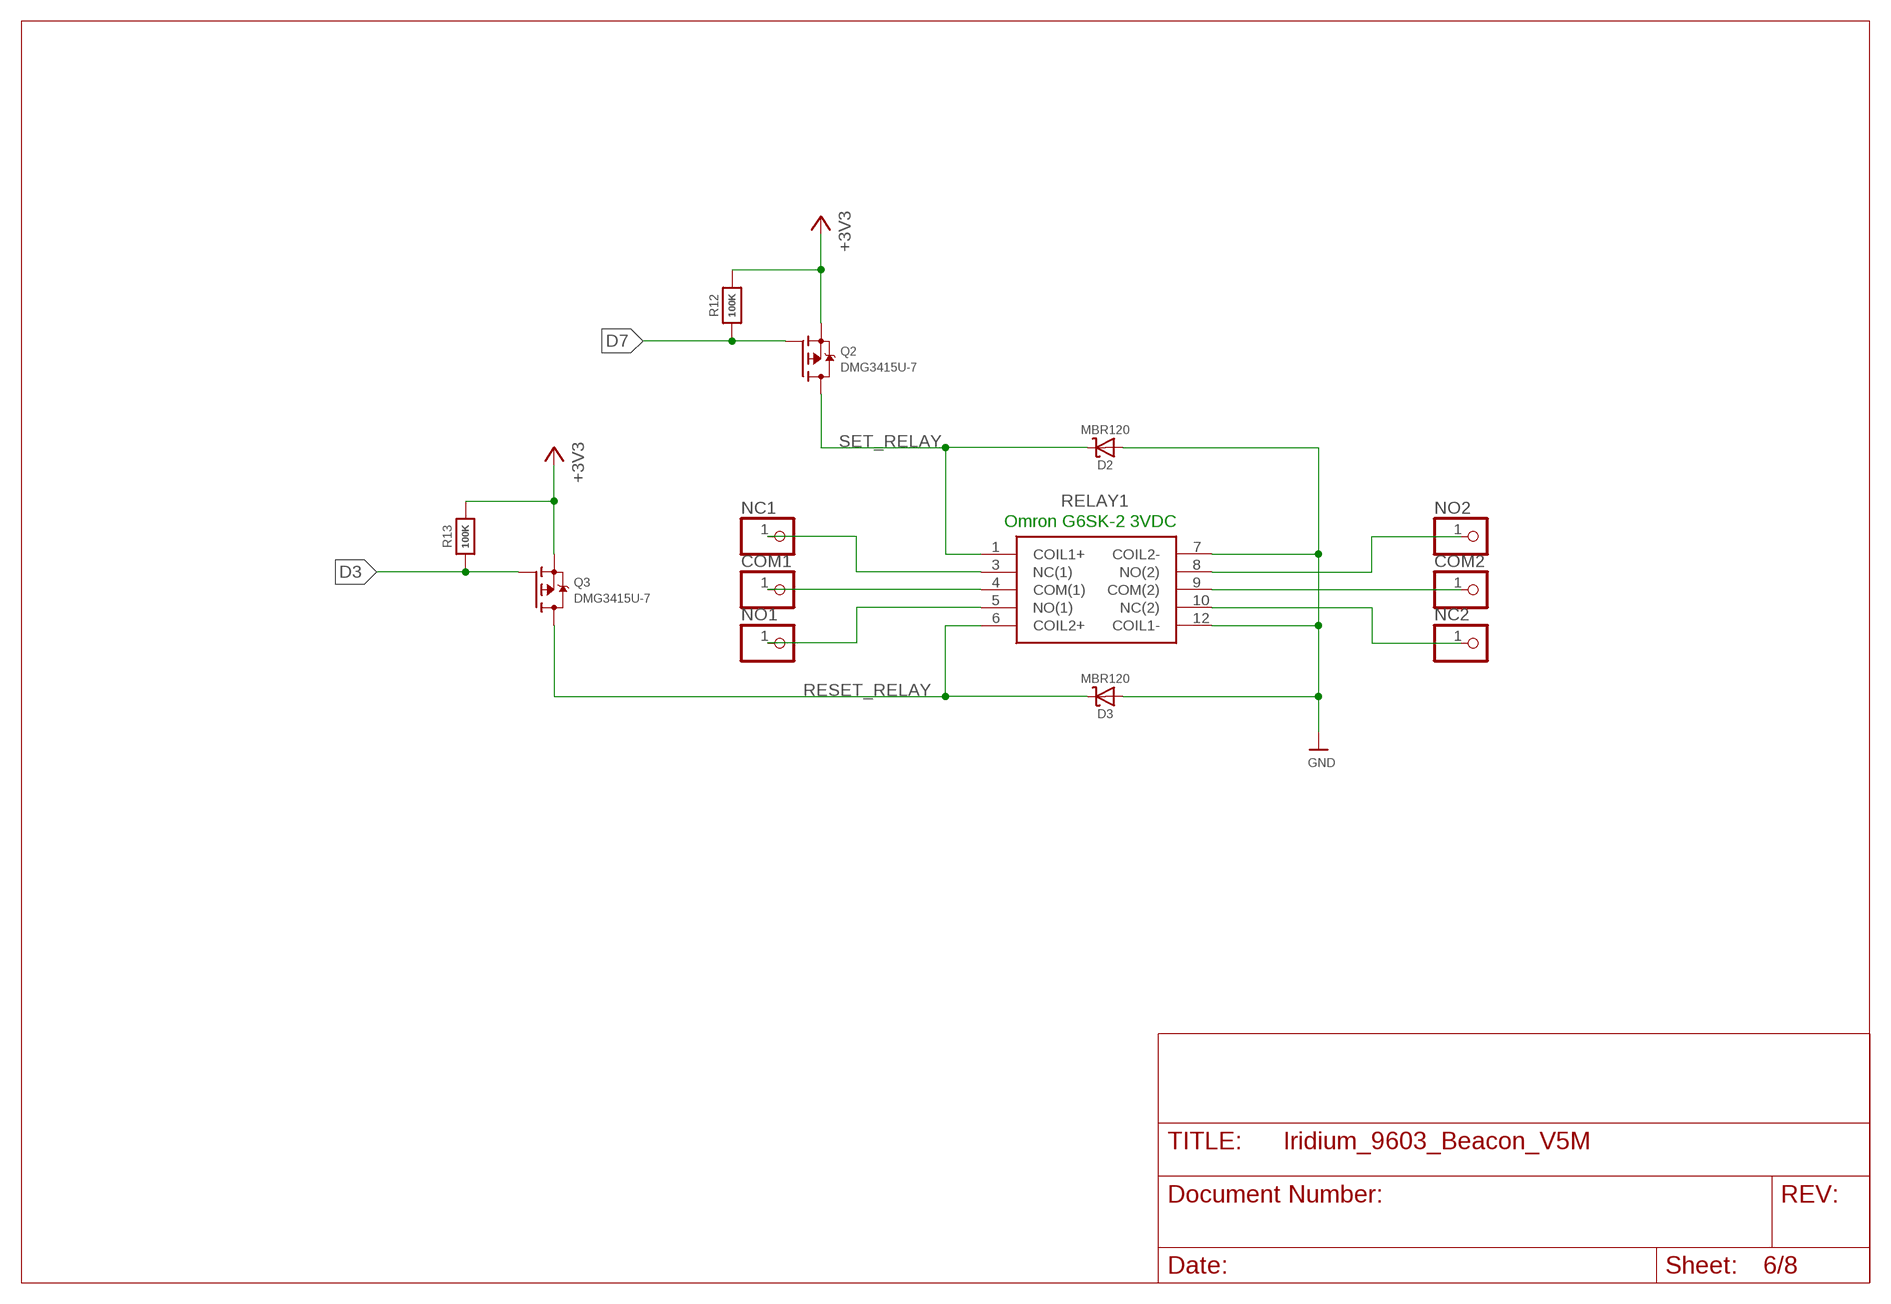
[diagram p5: schematic, sheet 6]

### Parts
COM1  PINHD-1X1  [1X01]
COM2  PINHD-1X1  [1X01]
D2  MBR120  DIODE-SCHOTTKYSOD-123  [SOD-123]
D3  MBR120  DIODE-SCHOTTKYSOD-123  [SOD-123]
NC1  PINHD-1X1  [1X01]
NC2  PINHD-1X1  [1X01]
NO1  PINHD-1X1  [1X01]
NO2  PINHD-1X1  [1X01]
Q2  DMG3415U-7  MOSFET-PWIDE  [SOT23-WIDE]
Q3  DMG3415U-7  MOSFET-PWIDE  [SOT23-WIDE]
R12  100K  RESISTOR0805_NOOUTLINE  [0805-NO]
R13  100K  RESISTOR0805_NOOUTLINE  [0805-NO]
RELAY1  G6SK-2_DC5  [G6SK2DC5]

### Nets
+3V3: Q2.2(S) Q3.2(S) R12.2 R13.2 ; also sheet 2,3,4,5
D3: Q3.1(G) R13.1 ; also sheet 2
D7: Q2.1(G) R12.1 ; also sheet 2
GND: D2.A D3.A RELAY1.7(COIL2-) RELAY1.12(COIL1-) ; also sheet 1,2,3,4,5
N$23: NC1.1 RELAY1.3(NC(1))
N$24: COM1.1 RELAY1.4(COM(1))
N$25: NO1.1 RELAY1.5(NO(1))
N$26: NO2.1 RELAY1.8(NO(2))
N$27: COM2.1 RELAY1.9(COM(2))
N$28: NC2.1 RELAY1.10(NC(2))
RESET_RELAY: D3.C Q3.3(D) RELAY1.6(COIL2+)
SET_RELAY: D2.C Q2.3(D) RELAY1.1(COIL1+)

### Notes on the sheet
- Omron G6SK-2 3VDC

## Sheet 7 of 8
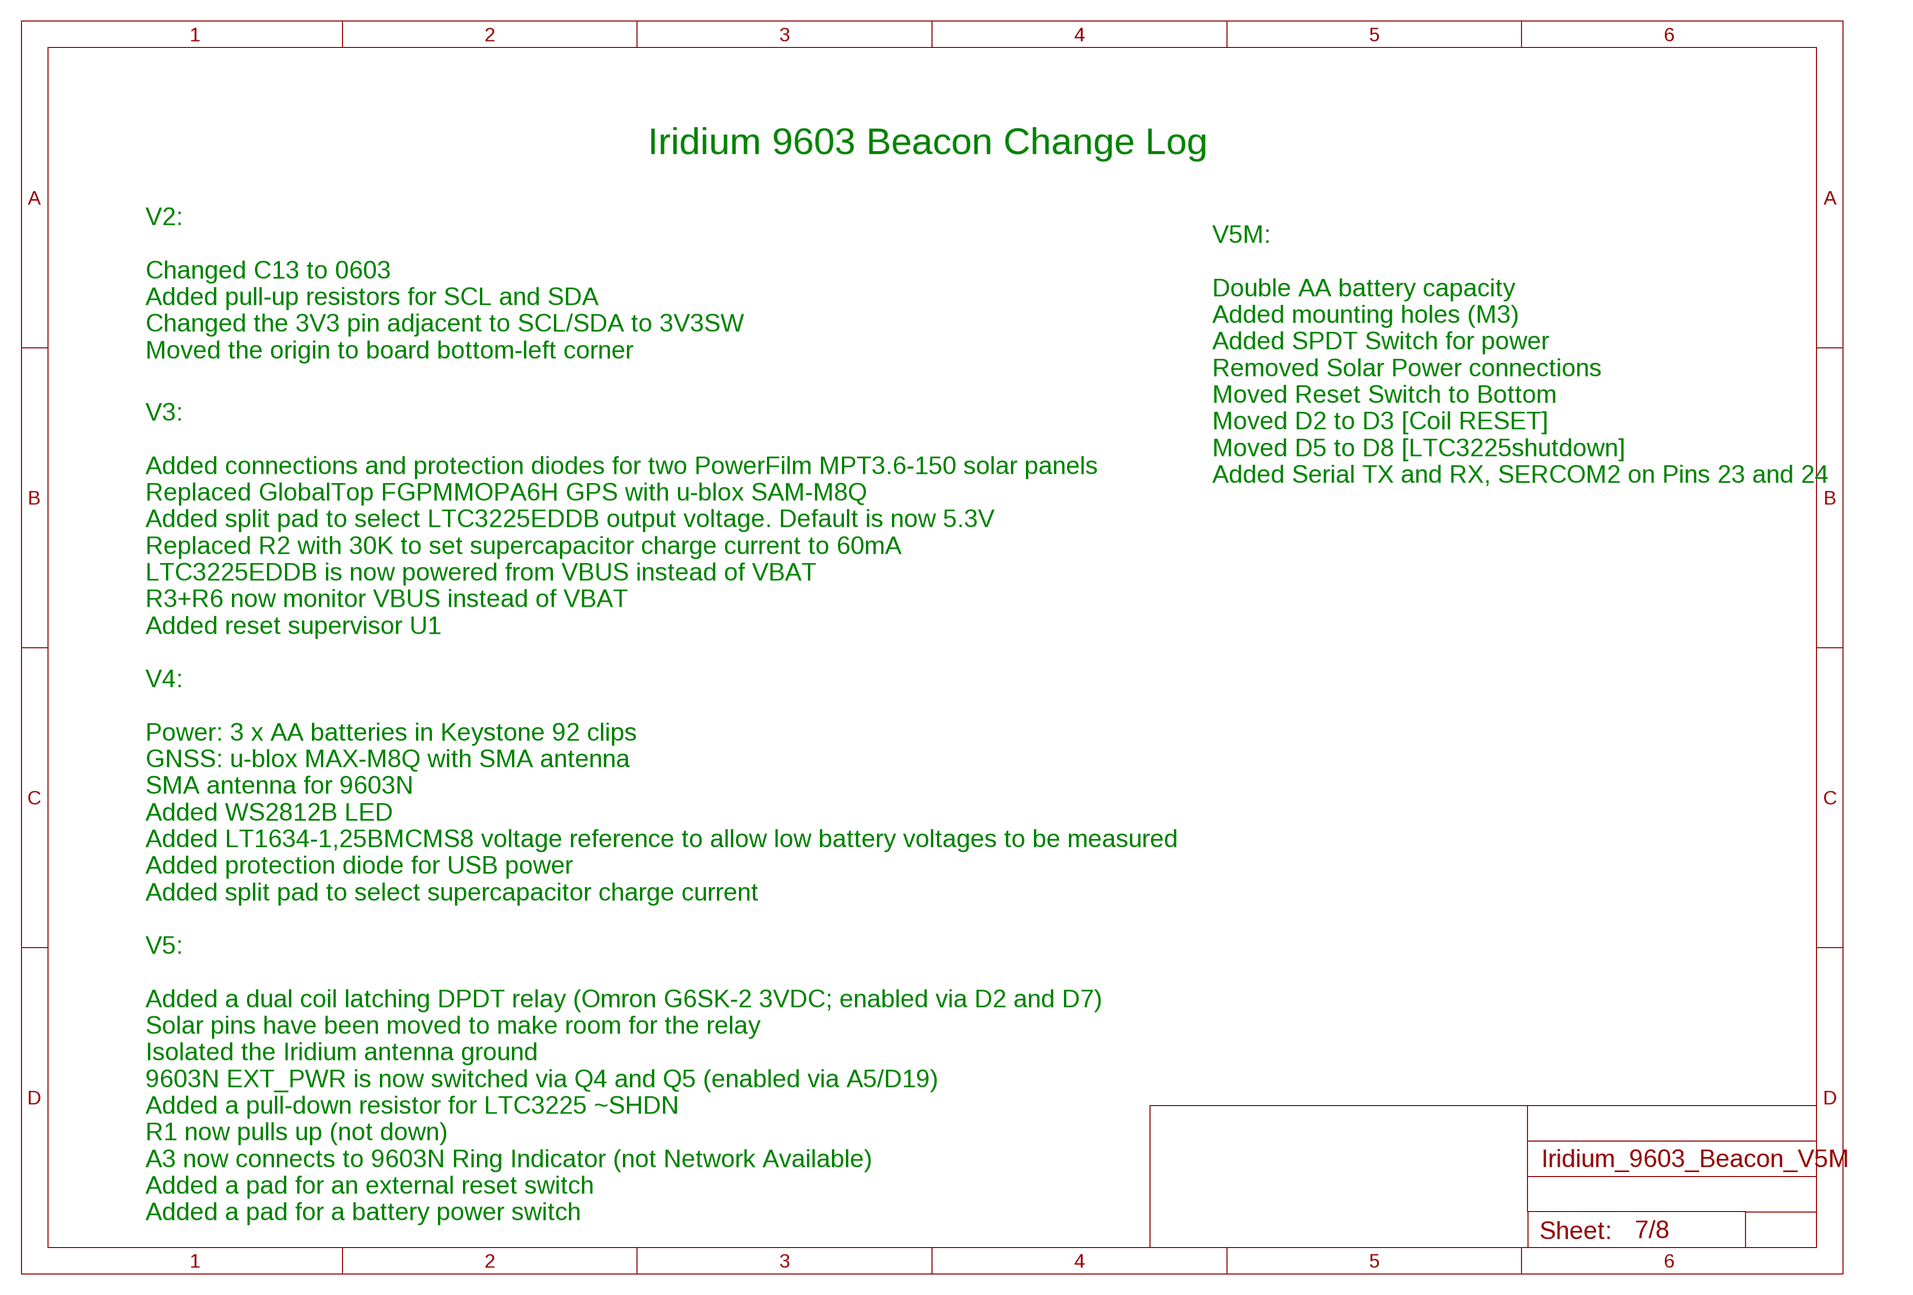
[diagram p6: schematic, sheet 7]

### Notes on the sheet
- Iridium 9603 Beacon Change Log
- V2:
  
  Changed C13 to 0603
  Added pull-up resistors for SCL and SDA
  Changed the 3V3 pin adjacent to SCL/SDA to 3V3SW
  Moved the origin to board bottom-left corner
- V5M:
  
  Double AA battery capacity
  Added mounting holes (M3)
  Added SPDT Switch for power
  Removed Solar Power connections
  Moved Reset Switch to Bottom
  Moved D2 to D3 [Coil RESET]
  Moved D5 to D8 [LTC3225shutdown]
  Added Serial TX and RX, SERCOM2 on Pins 23 and 24
- V3:
  
  Added connections and protection diodes for two PowerFilm MPT3.6-150 solar panels
  Replaced GlobalTop FGPMMOPA6H GPS with u-blox SAM-M8Q
  Added split pad to select LTC3225EDDB output voltage. Default is now 5.3V
  Replaced R2 with 30K to set supercapacitor charge current to 60mA
  LTC3225EDDB is now powered from VBUS instead of VBAT
  R3+R6 now monitor VBUS instead of VBAT
  Added reset supervisor U1
- V4:
  
  Power: 3 x AA batteries in Keystone 92 clips
  GNSS: u-blox MAX-M8Q with SMA antenna
  SMA antenna for 9603N
  Added WS2812B LED
  Added LT1634-1,25BMCMS8 voltage reference to allow low battery voltages to be measured
  Added protection diode for USB power
  Added split pad to select supercapacitor charge current
- V5:
  
  Added a dual coil latching DPDT relay (Omron G6SK-2 3VDC; enabled via D2 and D7)
  Solar pins have been moved to make room for the relay
  Isolated the Iridium antenna ground
  9603N EXT_PWR is now switched via Q4 and Q5 (enabled via A5/D19)
  Added a pull-down resistor for LTC3225 ~SHDN
  R1 now pulls up (not down)
  A3 now connects to 9603N Ring Indicator (not Network Available)
  Added a pad for an external reset switch
  Added a pad for a battery power switch

## Sheet 8 of 8
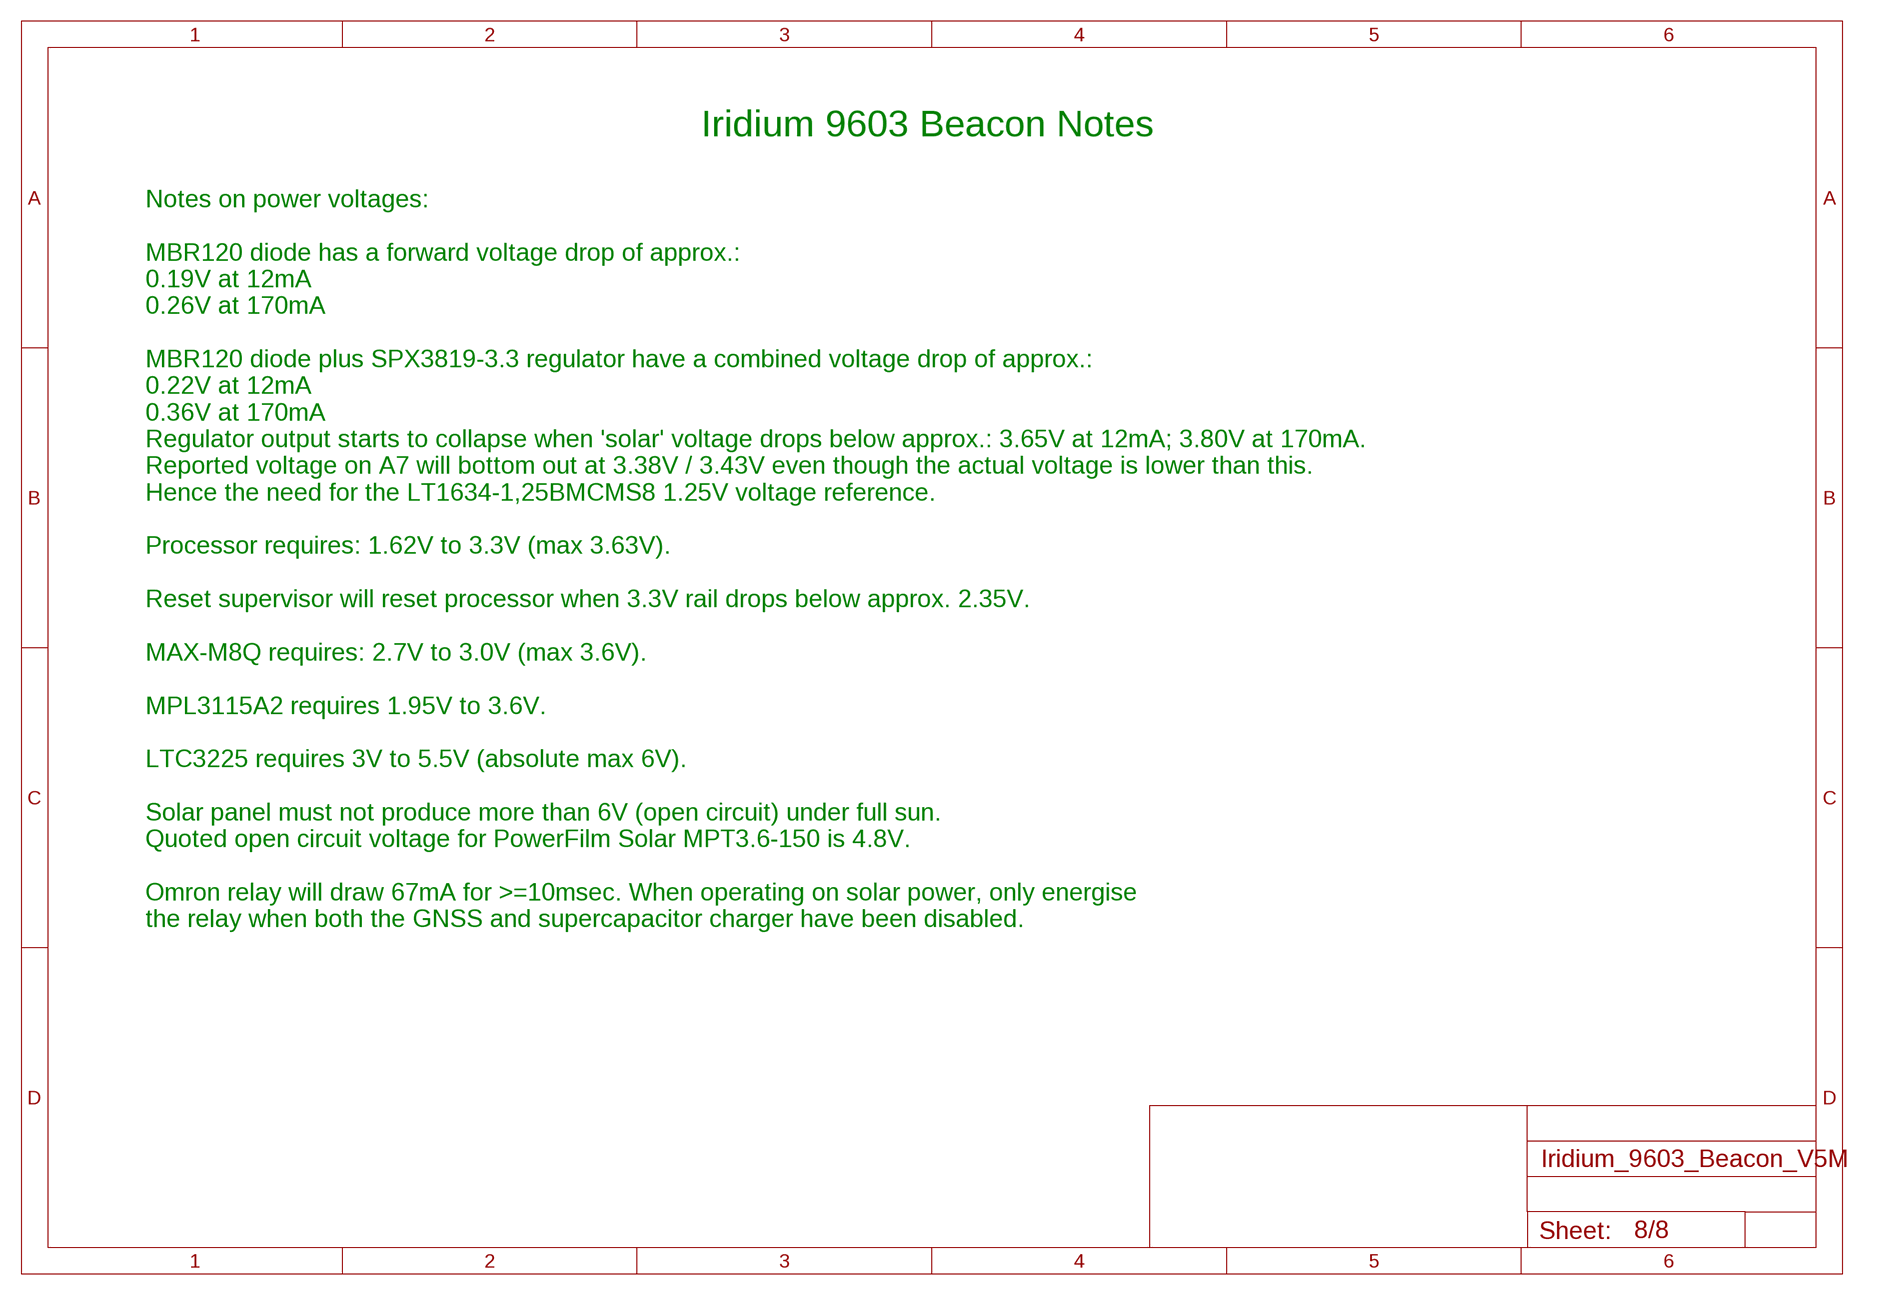
[diagram p7: schematic, sheet 8]

### Notes on the sheet
- Iridium 9603 Beacon Notes
- Notes on power voltages:
  
  MBR120 diode has a forward voltage drop of approx.:
  0.19V at 12mA
  0.26V at 170mA
  
  MBR120 diode plus SPX3819-3.3 regulator have a combined voltage drop of approx.:
  0.22V at 12mA
  0.36V at 170mA
  Regulator output starts to collapse when 'solar' voltage drops below approx.: 3.65V at 12mA; 3.80V at 170mA.
  Reported voltage on A7 will bottom out at 3.38V / 3.43V even though the actual voltage is lower than this.
  Hence the need for the LT1634-1,25BMCMS8 1.25V voltage reference.
  
  Processor requires: 1.62V to 3.3V (max 3.63V).
  
  Reset supervisor will reset processor when 3.3V rail drops below approx. 2.35V.
  
  MAX-M8Q requires: 2.7V to 3.0V (max 3.6V).
  
  MPL3115A2 requires 1.95V to 3.6V.
  
  LTC3225 requires 3V to 5.5V (absolute max 6V). 
  
  Solar panel must not produce more than 6V (open circuit) under full sun.
  Quoted open circuit voltage for PowerFilm Solar MPT3.6-150 is 4.8V.
  
  Omron relay will draw 67mA for >=10msec. When operating on solar power, only energise
  the relay when both the GNSS and supercapacitor charger have been disabled.

## Power pins joined to a net without a drawn wire
9_V_RESET_N: U6.9_RESET_N(9_V_RESET_N)

## Library data of the parts
3V3 3V3SW BAT- COM1 COM2 CS GND GND2-GND6 MISO MOSI NC1 NC2 NO1 NO2 RST SCK SCL SDA SERCOM2_RX SERCOM2_TX SWCLK SWDIO VBUS = adafruit:PINHD-1X1: Pin header 1x1 for 0.1" spacing With round pins
BAT1-BAT6 = SparkFun-Electromechanical:BATTERY: Battery Holders Various common sizes : AA, AAA, 18650 (PRT-12895), 20mm coin cell and 12mm coin cell. 20MM_4LEGS, BATT-10373
C1-C10 C13-C19 = microbuilder:CAP_CERAMIC: Ceramic Capacitors For new designs, use the packages preceded by an '_' character since they are more reliable: The following footprints should be used on most boards: _0402 - Standard footprint for regular board layouts _0603 - Standard footprint for regular board layouts _0805 - Standard footprint for regular board layouts _1206 - Standard footprint for regular board layouts For extremely tight-pitch boards where space is at a premium, the following 'micro-pitch' footprints can be used (smaller pads, no silkscreen outline, etc.): _0402MP - Micro-pitch footprint for very dense/compact boards _0603MP - Micro-pitch footprint for very dense/compact boards _0805MP - Micro-pitch footprint for very dense/compact boards _1206MP - Micro-pitch footprint for very dense/compact boards
C11 C12 = SparkFun-Capacitors:1F-2.7V(PTH): CAP-08070
CON1 = microbuilder:USB: USB Connectors USBMINIB - Surface Mount Female Mini-B USB Connector 4UConnector: 06564
CON4 = microbuilder:ANTENNA_U.FL: U.FL Antenna Connector
D1-D5 = microbuilder:DIODE-SCHOTTKY
FD1-FD3 = SparkFun-Aesthetics:FIDUCIAL: Fiducial Alignment Points Various fiducial points for machine vision alignment.
GNSS IRIDIUM = con-coax:SMA-: SMA 50 Ohm End Launch Jack Receptacle - Round Contact Johnson Components Source: www.johnsoncomponents.com .. J502-ND.pdf; MF: JOHNSON COMPONENTS; MPN: 142-0711-821; OC_FARNELL: 1019328; OC_NEWARK: 16F3627
J1 = SS4-10-3.50-X-D:SS4-10-3.50-X-D: 0.4mm[.016] SOCKET STRIP ASSEMBLY.
JP1 JP2 = SparkFun-Passives:JUMPER-PAD-3-2OF3_NC_BY_TRACE
L1 = microbuilder:FERRITE: Ferrite Bead 0603 MMZ1608B121C - 120 Ohm @ 100MHz, 600mA, 0.15 Ohm DC Resistance - Digikey: 445-2164-1-ND BK1608HW121-T - 120 Ohm, 600mA Ferrite Chip - Digikey: 587-1876-2-ND 0805 HZ0805B272R-10 - 2.7K Ohm @ 100MHz, 200mA, 0.8 Ohm DC Resistance - Digikey: 240-2504-1-ND (see also Murata BLM21BD272SN1L) MMZ2012Y152B - 1.5K Ohm @ 100MHz, 500mA, 0.4 Ohm DC Resistance - Digikey: 445-1560-1-ND - Mainly for high frequency (80-400MHz) MMZ2012R102A - 1K Ohm @ 100MHz, 500mA, 0.3 Ohm DC Resistance - Digikey: 445-1555-2-ND - More general purpose (10-200MHz)
LED1 = SparkFun-LED:WS2812B: WS2812B - Intelligent control LED integrated light source Technical Specifications: Power Supply Voltage (VDD): 3.5 to 5.3 V Input Voltage (VI): -0.5 to VDD+0.5 V Operating Junction Temperature (Topt): -25°C to +80°C Storage Temperature Range (Tstg): -55°C to +150°C; PROD_ID: DIO-12503
LED2 = microbuilder:LED: LED 0603 - 0603 Surface Mount Package 2mA: Green LED - Low Power (3.9mcd, 2ma, 1.7Vf) - Digikey: 475-2709-2-ND Orange LED - Low Power (9.8mcd, 2ma, 1.8Vf) - Digikey: 475-1194-2-ND Red LED - Low Power (5mcd, 2ma, 1.8Vf) - Digikey: 475-1195-2-ND Yellow LED - Low Power (7mcd, 2ma, 1.8Vf) - Digikey: 475-1196-2-ND 5mA: Blue LED - Low Power (17mcd, 5ma, 2.9Vf) - Digikey: LNJ937W8CRACT-ND 0805 - 0805 Surface Mount Package 2mA: Red LED (8.8mcd, 2mA, 1.8Vf, Clear) - Low Power [Digikey: 475-2510-1-ND] Green LED (5mcd, 2mA, 1.8Vf, Clear) - Low Power [Digikey: 475-2730-1-ND] Yellow LED (11.3mcd, 2mA, 1.8Vf, Clear) - Low Power [Digikey: 475-2555-1-ND] 20mA: Red LED (104mcd, 20mA, Diffused) - LS R976 [Digikey: 475-1278-6-ND] Red LED (12mcd, 20mA, 2.0Vf, Clear) - APT2012EC [Digikey: 754-1128-1-ND] Green LED (15mcd, 20mA, 2.2Vf, Clear) - APT2012GC [Digikey: 754-1131-1-ND] Orange LED (160mcd, 20mA, 2.1Vf, Clear) - APT2012SECK [Digikey: 754-1130-1-ND] 1206 - 1206 Surface Mount Package Green LED (26mcd, 20mA, Diffused) - LG N971 [Digikey: 475-1407-6-ND] Red LED (15mcd, 20mA, Diffused) - LH N974 [Digikey: 475-1416-6-ND] Cree - Cree High-Power Surface Mount LEDs XPEBWT-L1-0000-00D50 - White 111lm 350mA 2.9Vf 6200K 110° XTEAWT-00-0000-00000LEE3 - White 114lm 350mA 2.85Vf 5000K 115° Everlight - Everlight 45-21 Series Surface Mount LEDs 45-21/QK2C-B2832AC2CB2/2T - Warm White 2000mcd 20mA 3.25Vf 3050K 120° 45-21/LK2C-B38452C4CB2/2T - Nuetral White 2000mcd 20mA 3.25Vf 4150K 120° 45-21/LK2C-B50634C6CB2/2T - Cold White 2200mcd 20mA 3.25Vf 5650K 120° PLCC2 Reverse Mount LS T77K-J1L2-1-0-2-R18-Z - Red 11.25mcd 2mA 1.8Vf 630nm 120° LO T77K-L1M2-24-Z - Orange 19.6mcd 2mA 1.8Vf 606nm 120° LY T77K-K2M1-26-Z - Yellow 15.7mcd 2mA 1.8Vf 587nm 120°
Q1-Q4 = microbuilder:MOSFET-P: P-Channel Mosfet LEGEND VDS: Voltage Drain-Source ID: Drain Current RDS(ON): Drain-Source On-State Resistance VGS(TH): Gate-Source Threshold Voltage CISS: Drain-Source Input Capacitance SOT-23 Name VDS ID RDS(ON) VGS(TH) CISS Order Number IRLML5103 30V 760mA 600 mOhm -- 75pF @ 25V Digikey: IRLML5103PBFCT-ND IRLML6401 12V 4.3A 50 mOhm 950mV @ 250µA 830pF @ 10V Digikey: IRLML6401PBFTR-ND NTR0202PL 20V 400mA 800 mOhm 2.3V @ 250uA 70pF @ 5V Digikey: NTR0202PLT1GOSTR-ND NTR4101PT1G 20V 1.8A 85 mOhm 1.2V @ 250uA 675pF @ 10V Digikey: NTR4101PT1GOSCT-ND DMP2004K 20V 600mA 900 mOhm 1V @ 250uA 175pF @ 16V Digikey: DMP2004KDICT-ND PMV65XP 20V 3.9A 76 mOhm 950mV @ 1mA 725pF @ 20V Digikey: 568-2358-2-ND TO-252 Name VDS ID RDS(ON) VGS(TH) CISS Order Number AOD417 30V 25A 34 mOhm 3V @ 250µA 920pF @ 15V Digikey: 785-1106-2-ND
Q5 = transistor:*-NPN-: NPN Transistror BF959 corrected 2008.03.06
R1-R17 = microbuilder:RESISTOR: Resistors For new designs, use the packages preceded by an '_' character since they are more reliable: The following footprints should be used on most boards: _0402 - Standard footprint for regular board layouts _0603 - Standard footprint for regular board layouts _0805 - Standard footprint for regular board layouts _1206 - Standard footprint for regular board layouts For extremely tight-pitch boards where space is at a premium, the following 'micro-pitch' footprints can be used (smaller pads, no silkscreen outline, etc.): _0402MP - Micro-pitch footprint for very dense/compact boards _0603MP - Micro-pitch footprint for very dense/compact boards _0805MP - Micro-pitch footprint for very dense/compact boards _1206MP - Micro-pitch footprint for very dense/compact boards
RELAY1 = G6SK-2_DC5:G6SK-2_DC5: RELAY TELECOM DPDT 2A 5V Source: Datasheet <http://omronfs.omron.com/en_US/ecb/products/pdf/en-g6s.pdf>; DESCRIPTION: RELAY TELECOM DPDT 2A 5V; HEIGHT: 9mm; MANUFACTURER_NAME: Omron Electronics; MANUFACTURER_PART_NUMBER: G6SK-2 DC5
S1 S2 = SparkFun-Electromechanical:STANDOFF_ELECTRICAL: A standoff intended to be an electrically connected point.
SW1 = SparkFun-Electromechanical:SWITCH_SPST_4_PIN; PROD_ID: SWCH-13065
U1 = Microchip-MCP11:MCP11: Micropower Voltage Detector ,SOT23-3;; MPN: MCP111T-240E/TT; OC_FARNELL: 1851877; OC_NEWARK: 56J7328; PACKAGE: SOT23-3; SUPPLIER: MICROCHIP
U2 = microbuilder:VREG_SOT23-5: SOT23-5 Fixed Voltage Regulators Part Current Out V Out V In V Dropout θJA (°C/W) TJ (°C) Digikey Part No. ADP121 150mA 3.3V 3.4-5.5V 0.09V @ 150mA -- -- ADP121-AUJZ33R7CT-ND ADP121 150mA 3.0V 3.1-5.5V 0.09V @ 150mA -- -- ADP121-AUJZ30R7CT-ND ADP122 300mA 3.3V 3.4-5.5V 0.085V @ 300mA -- -- ADP122AUJZ-3.3-R7CT-ND ADP1712 300mA 3.3V 3.5-5.5V 0.17V @ 300mA -- -- ADP1712AUJZ-3.3-R7TR-ND AP7311 (Low Cost) 150mA 3.3V 3.5-6V 0.15V @ 150mA -- -- AP7311-33WG-7DICT-ND LD39015M18R 150mA 1.8V 1.9V-5.5V 0.08V @ 100mA -- -- 497-6977-1-ND LP2985A-33DBVR 150mA 3.3V 3.3-16V 0.28V @ 150mA 206 150 296-18479-1-ND MCP1824T-3302E/OT 300mA 3.3V 3.5V-6V 0.2V @ 300mA -- -- MCP1824T-3302E/OTCT-ND MIC5205-2.5YM5 TR 150mA 2.5V 2.7-16V 0.165V @ 150mA -- -- 576-1257-2-ND MIC5205-3.0YM5 TR 150mA 3.0V 3.2V-16V 0.165V @ 150mA -- -- 576-1258-2-ND MIC5205-3.3YM5 TR 150mA 3.3V 3.5V-16V 0.165V @ 150mA -- -- 576-1259-2-ND TPS780330220 150mA 3.3V+2.2V 3.6-5.5V 250mV Max -- -- 296-23332-1-ND TDA3663/N1,135 100mA 3.3V 3.5-45V 0.18V @ 50mA -- -- 568-5343-1-ND Max operating temp can be calculated using θJA, TJ (max junction temperature), and power in watts. Set the "Maximum Ambient Temperature" until it reaches TJ ("Max Junction Temperature"), which is the absolute limit for safe use of the regulator: Heat Sink Temperature Calculator <http://www.daycounter.com/Calculators/Heat-Sink-Temperature-Calculator.phtml> For example, With 12V source into a 3.3V LP2985 and a 30mA load, we are dissipating (12V-3.3V) * 0.03A = 0.261W. With a θJA of 206 °C/W, a TJ of 150°C, and 261mW we can safely use the chip without a heat sink up to 75°C (=147.1°C Junction Temperature).
U3 = LTC_By_element14_Batch_1:LTC3225EDDB-TRMPBF: 150mA Supercapacitor Charger
U4 = SparkFun-Sensors:MPL3115A2: Altimeter/Pressure Sensor, I2C, 1.95V-3.6V supply, 50 to 110kPa; PROD_ID: IC-10869
U5 = microbuilder:ATSAMD21J
U6 = ubloxLib:MAX-M8: u-blox MAX GNSS module
U7 = linear-technology:LT1634: Micropower Precision Shunt Voltage Reference Source: Darta sheet <http://cds.linear.com/docs/en/datasheet/1634fe.pdf>
U53 = argol-eagle-library:7101K2AV2QE: Digikey Par#: CKN1441-ND SPDT Switch 5A DC, 28 VDC -30C to +85C Locking Lever
X1 = adafruit2:XTAL: Low cost SMT crystals, no capacitors included http://www.ladyada.net/library/eagle

## Board
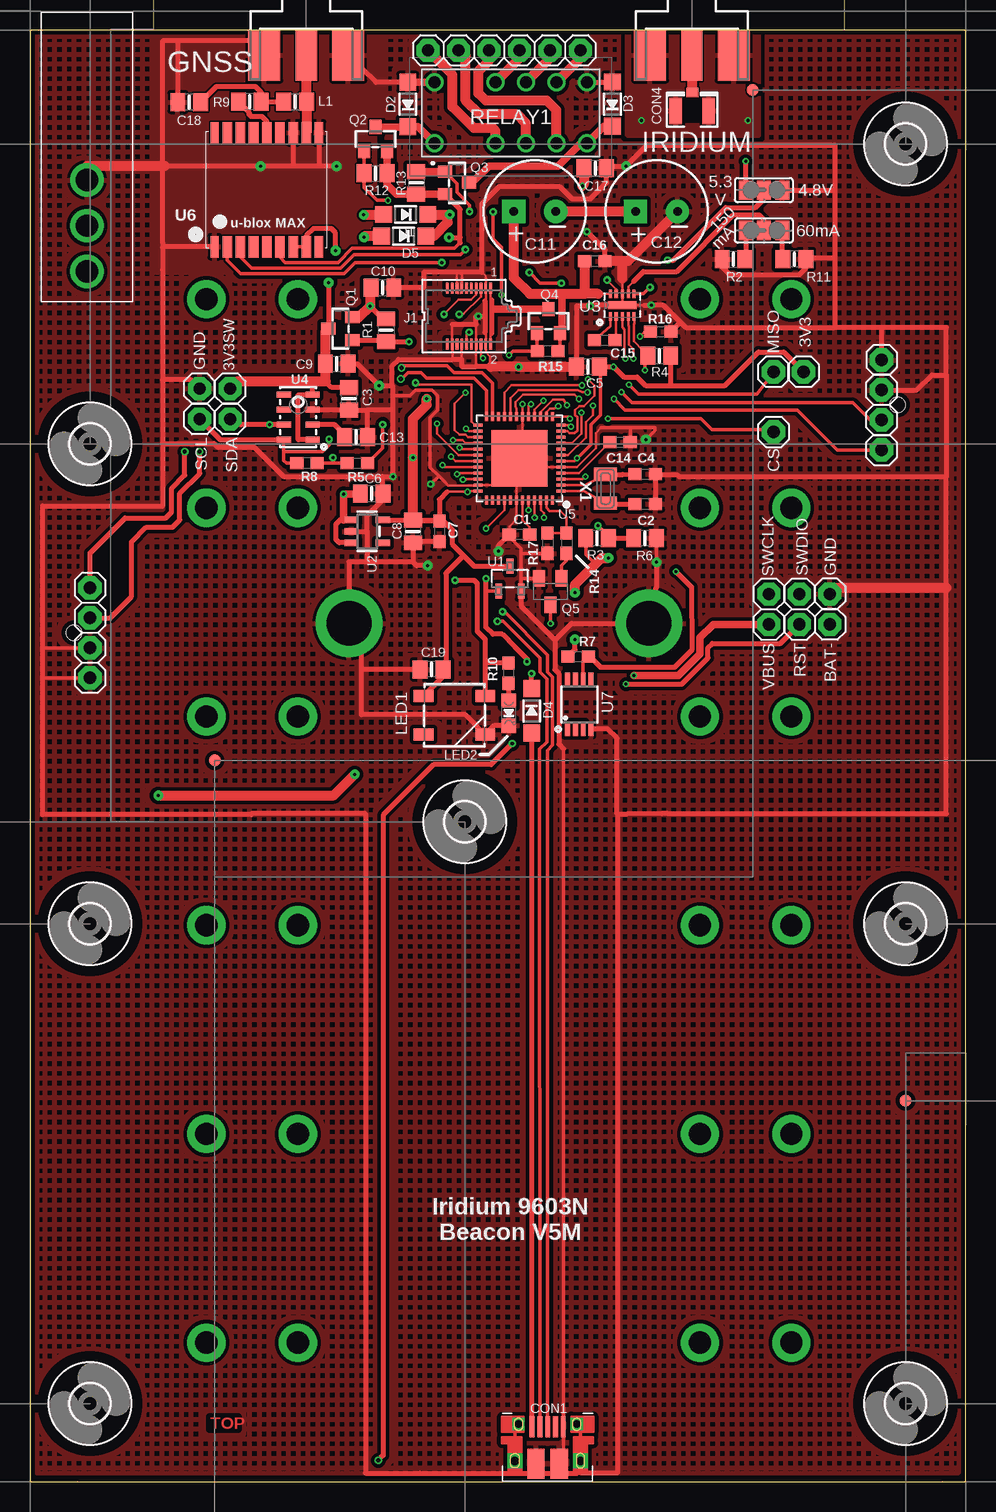
[diagram p8: board, top side]
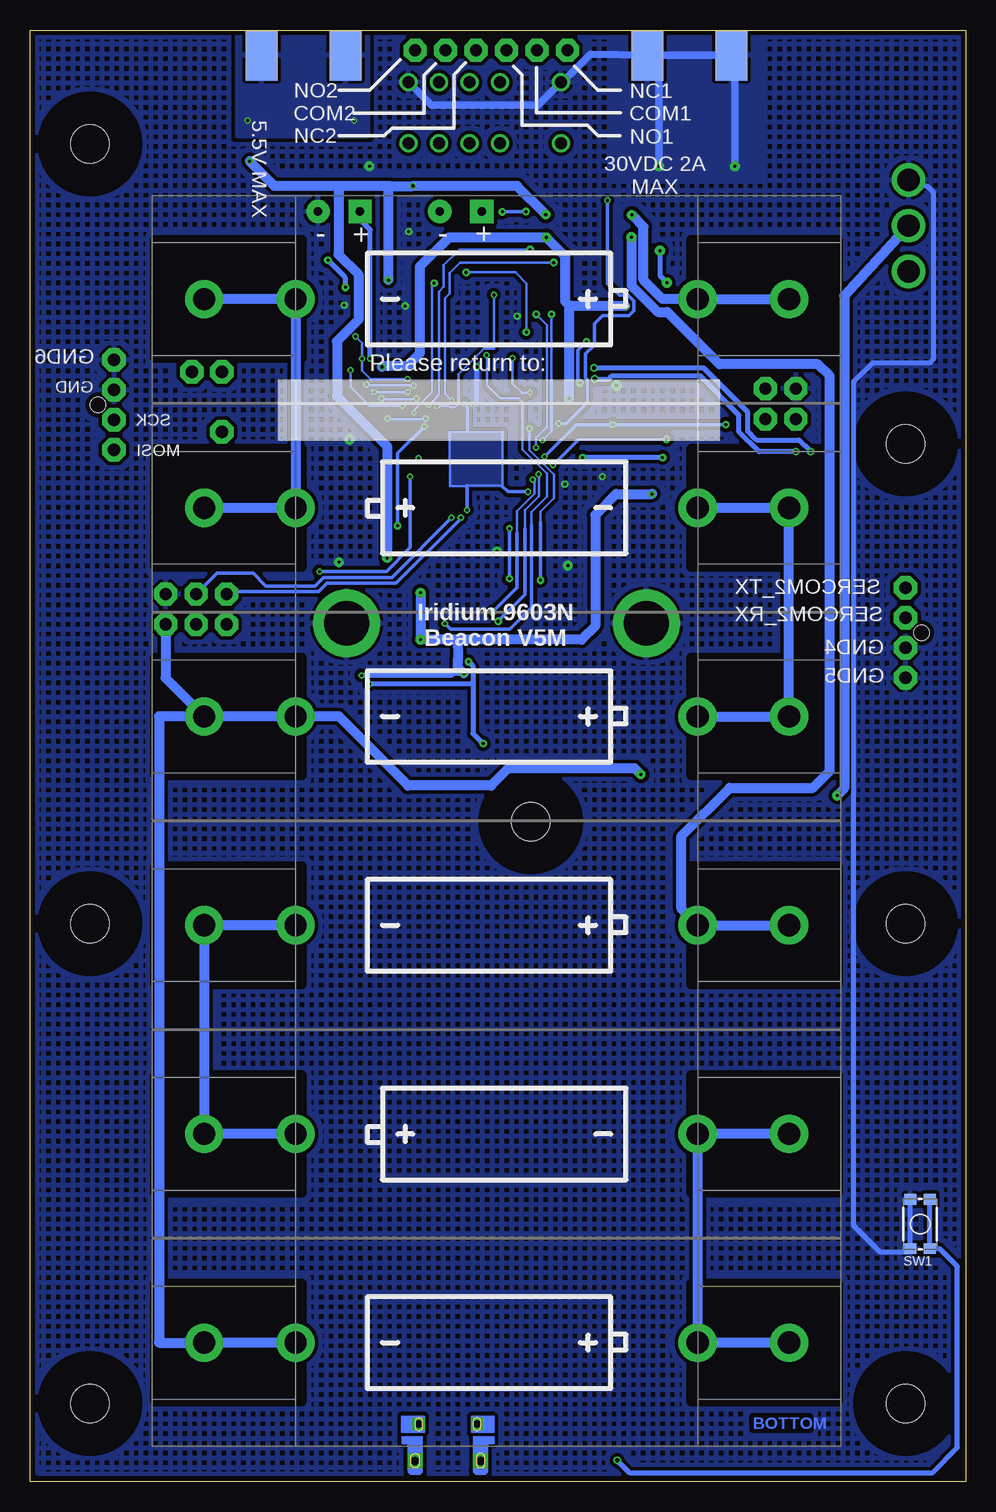
[diagram p9: board, bottom side, seen from below]

Size 78 x 121 mm. Coordinates in mm from the lower left corner, seen from the top.
Outline: 0,0 78,0 78,121 0,121 0,0
Copper layers (1*16): Top 0.035559375mm / dielectric 1.6mm / Bottom 0.035559375mm
Design rules "oshpark-2layer *": minimum track width 6mil, minimum drill 10mil, track to track 6mil, track to pad 6mil, pad to pad 6mil, via to via 6mil, smd to smd 0mil, copper to edge 15mil, drill to drill 6mil, minimum pad ring 5mil, minimum via ring 5mil, stop-mask expansion 2.5mil, vias tented up to drill 0mil, thermal gap 10mil
Holes 1.3 mm at 72.34,89.75 3.66,70.75

### Footprints (pad centres in the part's own frame; a part is rotated, then mirrored left to right if it is on the bottom)
1X01 = drill 1.016 pad 1.93 octagon: 1 0,0
BATTERY-AAA-KEYSTONE92 = drill 1.854 pad 3.175: GND@1 24.384,0; GND@2 16.764,0; PWR@1 -24.384,0; PWR@2 -16.764,0
0603-NO = smd 1.1 x 1: 1 -0.85,0; 2 0.85,0
0805-NO = smd 1.24 x 1.5: 1 -0.95,0; 2 0.95,0
CPOL-RADIAL-1F-2.7V = drill 0.7 pad 1.93 square: + 1.75,0 | drill 0.7 pad 1.93: - -1.75,0
FCI_10103594 = smd 1.425 x 2.5: BASE@1 -0.963,1.45; BASE@2 0.963,1.45 | smd 0.4 x 1.75: D+ 0,4.525; D- -0.65,4.525; GND 1.3,4.525; ID 0.65,4.525; VBUS -1.3,4.525 | drill 0.7 pad 1.25 square: SPRT@1 -2.736,1.679; SPRT@2 2.736,1.679 | drill 0.65 pad 1.016 square: SPRT@3 -2.426,4.747; SPRT@4 2.426,4.747
U.FL = smd 2.2 x 1.05: 1 0,1.375; 2 0,-1.375 | smd 0.8 x 1: 3 1.525,0
SOD-123 = smd 1.4 x 1.4: A 1.85,0; C -1.85,0
FIDUCIAL-1X2 = smd 1 x 1: 1 0,0
J502-ND-142-0711-821/826 = smd 4.191 x 1.778: 1 2.115,0 | smd 4.191 x 2.667: G@1 2.115,3.495; G@2 2.115,-3.495 | smd 4.191 x 2.667 bottom: G@3 2.115,3.495; G@4 2.115,-3.495
SS4-10-3.50-X-D = smd 0.23 x 0.93: 1 1.8,2.335; 2 1.8,-2.335; 3 1.4,2.335; 4 1.4,-2.335; 5 1,2.335; 6 1,-2.335; 7 0.6,2.335; 8 0.6,-2.335; 9 0.2,2.335; 10 0.2,-2.335; 11 -0.2,2.335; 12 -0.2,-2.335; 13 -0.6,2.335; 14 -0.6,-2.335; 15 -1,2.335; 16 -1,-2.335; 17 -1.4,2.335; 18 -1.4,-2.335; 19 -1.8,2.335; 20 -1.8,-2.335
PAD-JUMPER-3-2OF3_NC_BY_TRACE_YES_SILK_LARGE = smd 1.168 x 1.6: 1 -1.524,0; 2 0,0; 3 1.524,0
WS2812B = smd 1.651 x 1: 1 -2.577,1.6; 2 -2.577,-1.6; 3 2.577,-1.6; 4 2.577,1.6
CHIPLED_0805_NOOUTLINE = smd 1.2 x 1.2: A 0,-1.05; C 0,1.05
SOT23-WIDE = smd 1 x 1.2: 1 -0.95,-1; 2 0.95,-1; 3 0,1
SOT23-BEC = smd 1 x 1.4: B -0.95,-1.1; C 0,1.1; E 0.95,-1.1
G6SK2DC5 = drill 1 pad 1.5: 1 -6.35,-2.54; 3 -1.27,-2.54; 4 1.27,-2.54; 5 3.81,-2.54; 6 6.35,-2.54; 7 6.35,2.54; 8 3.81,2.54; 9 1.27,2.54; 10 -1.27,2.54; 12 -6.35,2.54
STANDOFF-ELECTRICAL-MCMASTER-95117A411 = drill 3.734 pad 5.588: P1 0,0
TACTILE_SWITCH_SMD_4.6X2.8MM = smd 0.9 x 1: 1 -2.05,-0.8; 2 2.05,-0.8; 3 2.05,0.8; 4 -2.05,0.8
SOT95P237X112-3N = smd 0.559 x 1.27: 1 -0.94,-1.041; 2 0.94,-1.041; 3 0,1.041
SOT23-5 = smd 0.55 x 1.2: 1 -0.95,-1.3; 2 0,-1.3; 3 0.95,-1.3; 4 0.95,1.3; 5 -0.95,1.3
DFN300X200-10L = smd 0.711 x 0.254: 1 -0.94,0.991; 2 -0.94,0.508; 3 -0.94,0; 4 -0.94,-0.508; 5 -0.94,-0.991; 6 0.94,-0.991; 7 0.94,-0.508; 8 0.94,0; 9 0.94,0.508; 10 0.94,0.991 | smd 0.635 x 2.388: 11 0,0
LGA8 = smd 1.2 x 0.5: 1 -1.2,1.875; 2 -1.2,0.625; 3 -1.2,-0.625; 4 -1.2,-1.875; 5 1.2,-1.875; 6 1.2,-0.625; 7 1.2,0.625; 8 1.2,1.875
TQFN48_7MM = smd 0.25 x 0.75: 1 -2.75,-3.475; 2 -2.25,-3.475; 3 -1.75,-3.475; 4 -1.25,-3.475; 5 -0.75,-3.475; 6 -0.25,-3.475; 7 0.25,-3.475; 8 0.75,-3.475; 9 1.25,-3.475; 10 1.75,-3.475; 11 2.25,-3.475; 12 2.75,-3.475; 25 2.75,3.475; 26 2.25,3.475; 27 1.75,3.475; 28 1.25,3.475; 29 0.75,3.475; 30 0.25,3.475; 31 -0.25,3.475; 32 -0.75,3.475; 33 -1.25,3.475; 34 -1.75,3.475; 35 -2.25,3.475; 36 -2.75,3.475 | smd 0.75 x 0.25: 13 3.475,-2.75; 14 3.475,-2.25; 15 3.475,-1.75; 16 3.475,-1.25; 17 3.475,-0.75; 18 3.475,-0.25; 19 3.475,0.25; 20 3.475,0.75; 21 3.475,1.25; 22 3.475,1.75; 23 3.475,2.25; 24 3.475,2.75; 37 -3.475,2.75; 38 -3.475,2.25; 39 -3.475,1.75; 40 -3.475,1.25; 41 -3.475,0.75; 42 -3.475,0.25; 43 -3.475,-0.25; 44 -3.475,-0.75; 45 -3.475,-1.25; 46 -3.475,-1.75; 47 -3.475,-2.25; 48 -3.475,-2.75 | smd 4.7 x 4.7: THERMAL 0,0
MAX-M8 = smd 1.8 x 0.7: 1_GND 4.95,-4.4; 9_RESET_N 4.95,4.3; 10_GND -4.55,4.3; 18_SAFEBOOT_N -4.55,-4.4 | smd 1.8 x 0.8: 2_TXD 4.95,-3.35; 3_RXD 4.95,-2.25; 4_TIMEPULSE 4.95,-1.15; 5_EXTINT 4.95,-0.05; 6_V_BCKP 4.95,1.05; 7_VCC_IO 4.95,2.15; 8_VCC 4.95,3.25; 11_RF_IN -4.55,3.25; 12_GND -4.55,2.15; 13_LNA_EN -4.55,1.05; 14_VCC_RF -4.55,-0.05; 15_V_ANT/RESERVED -4.55,-1.15; 16_SDA -4.55,-2.25; 17_SCL -4.55,-3.35
MSOP8 = smd 0.4 x 1.2: 1 -0.975,-2.05; 2 -0.325,-2.05; 3 0.325,-2.05; 4 0.975,-2.05; 5 0.975,2.05; 6 0.325,2.05; 7 -0.325,2.05; 8 -0.975,2.05
AV2_SPDT = drill 1.854: P$1 0,0; P$2 0,3.81; P$3 0,7.62
3,2 = hole 3.2: 0,0
XTAL3215 = smd 1.1 x 1.9: P$1 1.2,0; P$2 -1.2,0

### Placement (x,y rotation side)
3V3  64.5,92.5 270 top
3V3SW  16.68,91.11 90 top
BAT1  39.1,98.57 180 bottom
BAT2  39.1,81.17 0 bottom
BAT3  39.1,63.77 180 bottom
BAT4  39.1,46.37 180 bottom
BAT5  39.1,28.97 0 bottom
BAT6  39.1,11.57 180 bottom
BAT-  66.69,71.45 0 top
C1  40.81,78.95 180 top
C2  51.29,81.49 0 top
C3  26.59,90.25 270 top
C4  51.29,83.96 0 top
C5  46.52,92.92 180 top
C6  28.49,82.34 0 top
C7  34.14,79.2 270 top
C8  31.92,79.2 270 top
C9  25.57,93.17 0 top
C10  29.38,99.52 0 top
C11  42.08,105.87 180 top
C12  52.24,105.87 180 top
C13  27.19,87.08 0 top
C14  49.19,86.63 0 top
C15  47.92,95.14 0 top
C16  47.1,101.74 0 top
C17  47.13,109.49 0 top
C18  13.28,114.98 180 top
C19  33.48,67.71 180 top
COM1  35.73,119.3 0 top
COM2  43.35,119.3 0 top
CON1  43.16,0.04 0 top
CON4  55.22,114.25 90 top
CS  62,87.5 90 top
D1  31.32,105.62 180 top
D2  31.51,114.79 90 top
D3  48.56,114.82 90 top
D4  41.83,64.25 270 top
D5  31.15,103.82 180 top
FD1  15.41,60.12 0 top
FD2  60.27,116 0 top
FD3  73,31.75 0 top
GND  66.69,73.99 270 top
GND2  71,91 270 top
GND3  14.14,91.11 90 top
GND4  5,69.5 0 top
GND5  5,67 0 top
GND6  71,93.5 0 top
GNSS  23.03,121 270 top
IRIDIUM  55.19,121 270 top
J1  36.6,97.14 0 top
JP1  61.19,107.65 180 top
JP2  61.19,104.28 180 top
L1  22.11,115.02 0 top
LED1  35.38,63.87 0 top
LED2  39.92,64.06 180 top
MISO  62,92.5 270 top
MOSI  71,86 90 top
NC1  33.19,119.3 0 top
NC2  40.81,119.3 0 top
NO1  38.27,119.3 0 top
NO2  45.89,119.3 0 top
Q1  25.89,96.09 90 top
Q2  28.81,111.9 0 top
Q3  35.6,108.25 270 top
Q4  43.22,96.73 0 top
Q5  43.38,74.19 180 top
R1  29.7,95.97 270 top
R2  58.65,101.9 0 top
R3  47.29,78.63 180 top
R4  52.46,93.84 0 top
R5  27.28,84.89 0 top
R6  51.29,78.63 180 top
R7  45.7,68.76 0 top
R8  23.09,84.89 180 top
R9  18.33,115.02 180 top
R10  39.89,67.39 270 top
R11  63.73,101.9 180 top
R12  28.81,109.05 0 top
R13  32.21,108.25 270 top
R14  44.75,78.22 270 top
R15  43.16,94.22 180 top
R16  52.59,95.84 0 top
R17  43.16,78.22 270 top
RELAY1  40.08,114.09 0 top
RST  64.15,71.45 90 top
S1  26.6,71.54 0 top
S2  51.6,71.54 0 top
SCK  71,88.5 90 top
SCL  14.14,88.57 270 top
SDA  16.68,88.57 270 top
SERCOM2_RX  5,72 0 top
SERCOM2_TX  5,74.5 0 top
SW1  3.79,21.46 90 bottom
SWCLK  61.61,73.99 90 top
SWDIO  64.15,73.99 90 top
U1  40.02,75.27 0 top
U2  28.11,79.2 270 top
U3  49.38,98.06 90 top
U4  22.36,88.73 180 top
U5  40.81,85.3 90 top
U6  19.79,107.87 270 top
U7  45.8,64.79 0 top
U53  4.75,108.5 180 top
U$2  [3,2]  36.25,55 0 top
U$40  [3,2]  73,6.5 0 top
U$48  [3,2]  5,6.5 0 top
U$49  [3,2]  73,46.5 0 top
U$50  [3,2]  5,46.5 0 top
U$51  [3,2]  73,111.5 0 top
U$52  [3,2]  5,86.5 0 top
VBUS  61.61,71.45 90 top
X1  47.99,82.76 270 top

### Tracks (layer width: path | path; a pad name or v marks a point on that pad's centre or on a via)
3V3SW  (via drill 0.25 pad 0.81)
  Top 0.305: U6.7_VCC_IO U6.8_VCC
  Top 0.406: U4.1 22.36,86.85 22.36,90.6 U4.4 23.56,91.67 23.6,91.71 | v25.48,102.6 25.48,104.09 25.13,104.44 23.63,104.44 23.04,103.85 U6.8_VCC | v24.9,99.93 24.9,96.11 Q1.3 | C3.1 25.16,91.2 24.65,91.71
  Top 0.813: Q1.3 24.62,95.83 C9.1 24.65,93.14 24.65,91.71 23.6,91.71 17.28,91.71 3V3SW.1
  Bottom 0.406: v25.48,102.6 25.48,100.51 v24.9,99.93
!RESET  (via drill 0.25, 0.25 pad 0.46, 0.25 pad 0.61, 0.35)
  Top 0.203: U5.40 39.56,81 v38.02,79.46
  Top 0.305: U1.1 38.15,74.22 38.02,74.09
  Top 0.406: v29.04,1.77 29.46,2.18 29.46,55.56 33.66,59.77 38.46,59.77 v40.21,61.52 | v38.02,75.27 38.02,74.09 38.02,71.2 38.59,70.63 39.38,70.63 40.41,69.6 41.45,68.57 v41.45,68.34 | v49.7,66.47 54.35,66.47 56.53,68.65 56.53,69.52 56.88,69.87 62.57,69.87 RST.1
  Bottom 0.305: v38.02,75.27 v38.02,79.46
  Bottom 0.406: SW1.2 SW1.1 2.16,19.41 0.68,17.93 0.68,2.82 2.75,0.75 28.03,0.75 v29.04,1.77 | v41.45,68.34 41.06,67.96 41.06,66.47 | 41.06,66.47 41.06,62.34 40.24,61.52 v40.21,61.52 | 41.06,66.47 v49.7,66.47
+3V3  (via drill 0.25 pad 0.41, 0.25 pad 0.46, 0.25 pad 0.51, 0.25 pad 0.61, 0.25 pad 0.81)
  Top 0.203: U5.17 41.56,89.67 v41.76,89.81 | v41.57,80.98 41.57,81.56 41.56,81.57 U5.44 | U5.36 36.54,82.55 v36.49,82.5 34.78,82.5 | 47.56,92.83 C5.1 | U5.6 45.39,85.05 45.6,85.27 v45.6,85.3
  Top 0.305: 47.56,92.83 47.56,88.89 46.77,88.1 46.77,86.43 45.64,85.3 v45.6,85.3 | R5.1 R8.1 25.25,84.89 v25.25,85.36 | U6.6_V_BCKP 20.84,102.06 21.28,101.62 25.68,101.62 26.85,102.79 35.38,102.79 35.86,103.27
  Top 0.406: 36.16,77.19 35.19,78.15 35.19,79.36 34.4,80.15 U2.5 C8.1 31.92,80.05 C7.1 34.14,81.87 34.78,82.5 | 36.16,77.19 37.04,76.31 U1.3 | 36.16,77.19 34.68,75.71 34.68,67.97 C19.1 34.43,67.09 LED1.1 | Q3.2 35.86,106.05 35.86,103.71 | R1.1 29.45,96.92 v28.36,98 | v48.65,92.92 49.5,92.06 50.62,92.06 51.32,91.36 53.51,91.36 | 3V3.1 62.84,94.16 60.75,94.16 57.95,91.36 53.51,91.36 | v34.94,103.71 35.86,103.71 | 35.86,103.27 35.86,103.71 | R4.2 53.41,91.46 53.51,91.36 | C5.1 v48.65,92.92 | v48.65,92.92
  Top 0.61: Q2.2 R12.2 29.76,108.1 30.55,107.3 R13.2 Q3.2
  Top 0.813: C8.1 v31.92,85.36 31.92,88.6 33.06,89.74 v33.08,90.27 | Q1.2 27.41,97.04 v28.36,98 28.36,99.46 C10.1
  Bottom 0.203: 38.59,83.01 41.57,83.01 41.59,82.99 42.99,82.99 42.99,85 43.03,85.04 43.03,87.5 41.52,87.5 | 38.59,82.95 38.59,83.01 | 38.59,83.01 38.59,87.52 38.61,87.5 41.52,87.5 | 41.52,87.5 41.52,89.47 41.57,89.53 41.57,89.55
  Bottom 0.305: 43.03,85.04 45.38,85.04 45.6,85.27 v45.6,85.3 | v41.57,80.98 41.57,83.01 | 38.59,82.95 38.14,82.5 v36.49,82.5 | v41.76,89.81 41.76,89.74 41.57,89.55
  Bottom 0.406: v25.25,85.36 v31.92,85.36
  Bottom 0.813: 33.06,98.06 v33.08,90.27 | 33.06,98.06 33,98 v28.36,98 | 33.06,98.06 33.38,98.38 33.38,102.15 v34.94,103.71 43.07,103.71 45.51,101.27 45.51,94.03 46.56,92.98 48.59,92.98 v48.65,92.92
  pour Bottom: 38.59,87.52 43.03,87.52 43.03,82.95 38.59,82.95
A0  (via drill 0.25 pad 0.46)
  Top 0.203: U5.3 46.08,83.55 v46.3,83.77
  Top 0.305: 46.95,68.51 46.7,68.76 R7.2 46.47,68.76 46.12,68.4 46.12,67.19 U7.6
  Top 0.406: 46.95,68.51 47.59,67.86 53.73,67.86 55.17,69.3 55.16,74.57 v53.86,75.87
  Bottom 0.305: v46.3,83.77 46.3,77.84 48.27,75.87 v53.86,75.87
A1  (via drill 0.25 pad 0.46)
  Top 0.203: U5.7 44.87,85.55 46.35,87.03 46.35,88.33 46.93,88.91 v46.93,89.68 | R4.1 51.51,94.06 51.29,94.28 51.11,94.28 50.33,95.06 50.33,96.48 50.38,96.53 U3.5
  Top 0.305: v51.29,92.63 51.29,93.61 R4.1
  Bottom 0.203: v46.93,89.68 49.7,89.68 51.29,91.27 v51.29,92.63
A3  (via drill 0.25 pad 0.46, 0.25 pad 0.61)
  Top 0.152: U5.9 44.48,86.55 44.49,86.56
  Top 0.203: 44.49,86.56 45.18,86.56 45.99,87.37 45.99,89.08 v45.96,89.11 | J1.12 36.4,95.59 v36.62,95.81
  Top 0.305: v41.64,100.79 42.52,99.9 v44.3,99.9
  Bottom 0.203: v41.64,100.79 37.54,100.79 36.62,99.87 v36.62,95.81 | v45.96,89.11 45.96,89.32 44.49,90.79 44.49,99.71 v44.3,99.9
A5
  Top 0.203: U5.47 43.06,81.17 43.32,80.92 44.24,80.92 44.75,80.41 R14.1 R17.1
AREF
  Top 0.203: U5.4 45.76,84.05 C14.1
D0  (via drill 0.25 pad 0.46, 0.25 pad 0.61)
  Top 0.203: U5.16 42.06,89.36 v42.8,90.1
  Top 0.305: v34.33,101.62 27.09,101.62 26.17,100.69 17.54,100.69 16.44,101.79 U6.2_TXD
  Bottom 0.203: v34.33,101.62 42.14,101.62 43.03,100.73 43.03,99.01 43.38,98.67 43.38,90.68 v42.8,90.1
D1  (via drill 0.25 pad 0.46, 0.25 pad 0.61)
  Top 0.152: U5.15 42.56,89.14
  Top 0.203: 42.56,89.14 43.6,90.19 44.46,90.19 v44.78,89.73
  Top 0.305: U6.3_RXD 17.54,102.11 18.5,101.15 25.9,101.15 27.03,102.28 35.89,102.28 v36.3,102.7
  Bottom 0.203: v36.3,102.7 42.21,102.7 43.51,101.39 43.51,99.58 43.89,99.2 43.89,90.65 44.78,89.62 v44.78,89.73
D2  (via drill 0.35)
  Top 0.305: U5.23 38.56,91.56 37.69,92.44 35.34,92.44 34.76,93.01 31.15,93.01 v30.97,92.83
  Top 0.406: SERCOM2_TX.1 5,77.4 7.92,80.32 11.32,80.32 11.8,80.8 11.8,82.77 12.91,83.88 v12.91,85.85
  Bottom 0.406: v30.97,92.83 21.83,92.83 18.15,89.15 18.15,87.56 17.42,86.83 13.89,86.83 v12.91,85.85
D3  (via drill 0.25 pad 0.46, 0.25 pad 0.61)
  Top 0.203: v44.04,89.66 43.71,89.44 43.36,89.44 43.06,89.13 U5.14
  Top 0.305: Q3.1 35.6,108.2 35.6,107.46 36.65,106.41 v36.65,105.87 | v38.62,105.84 38.62,103.59 39.32,102.89 v39.32,98.92
  Top 0.61: R13.1 Q3.1
  Bottom 0.203: v39.32,98.92 39.32,94.42 40.16,94.42 42.27,92.31 42.27,89.86 42.58,89.56 42.98,89.56 43.1,89.68 v44.04,89.66
  Bottom 0.305: v36.65,105.87 38.59,105.87 v38.62,105.84
D5  (via drill 0.35)
  Top 0.305: U5.24 38.06,90.95 37.04,91.97 33.07,91.97 32.6,92.44 31.51,92.44 30.98,91.91 v30.91,91.91
  Top 0.406: SERCOM2_RX.1 6.68,72 8.46,73.78 8.46,78.32 9.7,79.56 11.89,79.56 12.5,80.16 12.5,82.39 14.15,84.04 v14.15,85.85
  Bottom 0.406: v30.91,91.91 29.74,91.91 29.47,92.17 22.16,92.17 18.88,88.89 18.88,87.5 17.23,85.85 v14.15,85.85
D6  (via drill 0.25 pad 0.46, 0.25 pad 0.61)
  Top 0.203: J1.5 37.6,98.79 36.11,97.3 v35.79,97.3 | v35.81,86.19 35.95,86.05 U5.29
  Bottom 0.203: v35.79,97.3 34.91,96.4 34.91,87.94 35.81,87.03 v35.81,86.19
D7  (via drill 0.25, 0.25 pad 0.46)
  Top 0.203: U5.30 35.72,85.55 33.93,87.34 v33.93,88.19
  Top 0.305: Q2.1 R12.1 27.86,107.87 28.94,106.79 v29.86,106.79
  Bottom 0.305: v33.93,88.19 33.32,88.19 31.53,89.98 31.53,91.86 31.67,92 31.67,94 30.95,94.73 30.95,96.52 30.27,97.2 28.05,97.2 27.64,97.61 27.64,98.38 28.14,98.89 28.87,98.89 29.86,99.87 v29.86,106.79
D8  (via drill 0.25 pad 0.46)
  Top 0.203: U3.4 49.89,96.35 49.94,96.3 49.94,94.78 50.3,94.41 v50.3,93.62 | R16.1 51.22,95.84 v50.84,95.46 | v46.53,91.89 47.07,91.35 47.07,90.54 46.19,89.66 45.79,89.66 45.44,89.31 45.44,88.91 45.63,88.72 45.63,87.61 45.4,87.38 44.97,87.38 44.8,87.55 U5.11
  Bottom 0.203: v50.84,95.46 50.3,94.92 v50.3,93.62 50.3,92.6 49.61,91.9 46.54,91.9 v46.53,91.89
D9  (via drill 0.25 pad 0.46, 0.25 pad 0.61)
  Top 0.203: U5.12 45.02,88.05 v45.12,87.95
  Top 0.305: R3.1 48.24,78.79 v47.35,79.68
  Top 0.406: R3.1 R6.2
  Bottom 0.305: v47.35,79.68 47.35,85.75 v45.12,87.95
D10  (via drill 0.25 pad 0.46)
  Top 0.203: U5.27 36.52,87.05 36.3,87.27 35.79,87.27 35.41,87.65 35.41,89.87 v36.3,90.76 | J1.6 37.6,93.79 v37.76,93.63
  Bottom 0.203: v36.3,90.76 37,90.76 37.75,91.51 v37.75,93.62 v37.76,93.63
D11  (via drill 0.25 pad 0.61)
  Top 0.152: U5.25 37.11,88.05 | 37.11,88.05
  Top 0.203: 37.11,88.05 36.81,88.35 36.81,91.46 32.28,91.46 v32.14,91.6
  Top 0.406: Q1.1 29.57,95.14 R1.2 v31.6,95.02 v31.6,95.01
  Bottom 0.305: v31.6,95.01 32.3,94.31 32.3,91.87 32.14,91.71 v32.14,91.6
D12  (via drill 0.25 pad 0.46, 0.25 pad 0.61)
  Top 0.152: U5.28 37.16,86.55 37.13,86.57
  Top 0.203: v35.28,86.82 36.05,86.82 36.3,86.57 37.13,86.57 | J1.7 37.2,98.93 36.78,98.51 35.73,98.51 v34.52,97.3
  Bottom 0.203: v34.52,97.3 34.52,87.55 35.25,86.82 v35.28,86.82
D13  (via drill 0.25 pad 0.46, 0.25 pad 0.61)
  Top 0.203: v36.37,87.77 36.59,87.55 U5.26
  Top 0.406: 37.96,68.25 LED1.4 | R10.1 37.97,68.24 37.96,68.25 | v35.44,75.14 37.03,75.14 37.29,74.88 37.29,70.88 37.96,70.21 37.96,68.25
  Bottom 0.203: 35.44,79.96 35.44,80.85 34.33,81.96 34.33,83.94 36.37,85.97 v36.37,87.77
  Bottom 0.305: 35.44,79.96 v35.44,75.14
D+  (via drill 0.25 pad 0.46, 0.25 pad 0.61)
  Top 0.203: U5.34 36.39,83.55 36.37,83.53 v36.09,83.53
  Top 0.305: CON1.D+ 43.14,60.96 43.57,61.39 43.57,67.08 43.16,67.49 43.16,68.92 39.57,72.5 v39.41,72.5
  Bottom 0.203: 37.38,79.08 37.38,80.89 35.93,82.34 35.93,83.37 v36.09,83.53
  Bottom 0.305: v39.41,72.5 37.38,74.53 37.38,79.08
D-  (via drill 0.25 pad 0.46, 0.25 pad 0.61)
  Top 0.203: U5.33 35.67,84.05 v35.61,83.99
  Top 0.305: CON1.D- 42.49,61.06 43.09,61.66 43.09,66.89 42.51,67.47 42.51,68.64 39.45,71.71 v38.97,71.71
  Bottom 0.203: 36.75,79.46 36.75,80.98 35.57,82.15 35.57,83.95 v35.61,83.99
  Bottom 0.305: 36.75,79.46 36.75,73.93 v38.97,71.71
EXT_PWR
  Top 0.203: J1.1 38.4,98.56 38.47,98.52 | 38.47,98.52 | 38.47,98.52 38.49,98.51 | 38.49,95.71 38.4,95.65 J1.2
  Top 0.406: 38.49,97.71 38.49,95.71 | 38.49,98.51 38.49,97.71 | 38.72,97.71 38.49,97.71 | 42.97,97.71 Q4.3
  Top 0.61: 38.72,97.71 42.97,97.71
GND  (via drill 0.25 pad 0.46, 0.25 pad 0.61, 0.25 pad 0.81)
  Top 0.152: 38,100.25 38,100.46 37.67,100.79 | J1.15 35.6,100.79
  Top 0.203: 38.56,83.05 U5.35 37.3,83.02 34.87,83.02 34.59,83.3 | 41.06,85.55 U5.18 v41.06,89.8 v41.06,89.81 | C1.2 39.96,79.62 40.56,80.22 U5.42 40.56,85.05 U5.THERMAL | 47.6,87.84 47.18,87.41 47.18,86.14 45.58,84.55 U5.5 41.56,84.55 U5.THERMAL | 35.22,93.52 35.22,94.81 J1.18 35.2,96.47 | 49.38,100.28 U3.8 U3.11 51.22,98.06 | 37.2,96.47 J1.8 37.19,92.96 37.19,92.95 | J1.14 35.98,94.79 35.98,93.52 | J1.13 36,100.71 35.92,100.79 | 37.92,98.43 38,98.51 J1.3 38,100.25 | 37.92,95.78 38,95.69 J1.4 38,94.14 38.37,93.78 38.37,92.95 38.4,92.92 | 30.27,91.3 30.21,91.36 | 41.06,85.55 | 38.56,83.05 | U5.THERMAL 41.06,85.55 | U5.THERMAL | U5.THERMAL 38.56,83.05
  Top 0.305: 50.04,87.84 C14.2 | 50.04,87.84 52.11,87.84 52.11,87.61 v51.35,86.85 | 47.6,87.84 50.04,87.84 | 44.49,61.07 44.49,4.6 CON1.GND 44.49,4.57 44.49,2.14 44.12,2.14 CON1.BASE@2 | CON1.SPRT@3 40.42,4.79 CON1.SPRT@1 40.49,1.72 40.49,0.68 | CON1.SPRT@4 45.9,4.79 CON1.SPRT@2 45.57,1.72 45.57,0.68 | 34.05,83.84 33.35,84.54 33.35,88.69 33.98,89.33 33.98,90.5 33.51,90.98 32.14,90.98 31.7,90.54 30.27,90.54 | 34.05,83.84 34.59,83.3 | 39.87,78.86 40.96,77.77 40.96,77.33 | 40.96,77.33 40.96,75.36 | 40.96,75.36 U1.2 | R6.1 v52.24,76.63 | Q5.E 41.03,75.28 40.96,75.36 | R17.2 40.99,77.37 40.96,77.33 | v33.41,83.14 34.05,83.77 34.05,83.84 | GND4.1 1.07,69.5 1.06,69.5 | GND5.1 1.07,67 1.06,66.99
  Top 0.406: 67.1,107.65 67.1,111.4 51.45,111.4 v49.7,109.65 48.24,109.65 C17.2 48.08,108.25 46.75,106.92 45.19,106.92 44.14,107.97 39.13,107.97 37.67,106.51 37.67,100.79 35.92,100.79 35.6,100.79 32.81,100.79 32.81,99.52 C10.2 | 67.1,107.65 67.1,102.03 | 67.1,102.03 67.1,96.22 67.07,96.19 | 11.06,102.89 11.06,103.3 11.06,109.65 | 11.06,102.89 11.05,100.98 11.06,91.84 | 11.06,91.84 11.06,86.54 | 11.06,86.54 11.06,81.31 1.06,81.32 1.06,69.5 1.06,66.99 1.06,55.6 18.47,55.6 18.47,55.67 27.96,55.67 27.96,0.71 32.5,0.71 42.38,0.68 42.2,0.86 CON1.BASE@1 42.08,1.37 42.08,0.68 | 40.49,0.68 42.08,0.68 | 42.08,0.68 45.57,0.68 | 48.94,55.65 49.76,55.64 52.68,55.67 53.19,55.67 76.4,55.67 76.4,74.48 76.4,83.75 | U2.2 28.11,79.2 | 28.11,79.2 28.11,76.66 | 28.11,76.66 26.6,76.66 S1.P1 27.63,70.51 27.63,67.74 | C7.2 31.92,78.35 C8.2 31.92,76.66 | 31.92,76.66 28.11,76.66 | C4.2 52.14,83.86 | 52.14,83.86 C2.2 | C5.2 | C5.2 v40.75,92.92 | 37.19,92.96 35.98,92.96 35.98,93.52 35.22,93.52 30.71,93.52 30.21,93.01 30.21,91.36 v29.09,91.36 27.28,93.17 C9.2 | 51.22,98.06 v51.8,98.06 52.81,98.06 54.35,96.52 | C5.2 45.57,98 v46.72,98 46.78,98.06 U3.11 | 39.87,78.86 C1.2 39.06,78.05 v39.06,77.55 | 30.27,89.35 30.27,90.54 30.27,91.3 | 28.13,89.35 30.27,89.35 | v33.16,76.34 32.24,76.34 31.92,76.66 | GND3.1 13.41,91.84 11.06,91.84 | 11.06,109.65 11.06,120.06 11.12,120.13 12.33,120.13 | 12.33,120.13 C18.2 | 27.63,67.74 27.63,63.93 36.29,63.93 LED1.3 38.7,63.01 LED2.C | 48.94,55.65 48.94,61.96 48.16,62.74 U7.4 | v52.24,76.63 52.24,74.53 52.18,74.47 52.18,72.12 S2.P1 45.15,71.54 43.76,70.15 | U4.3 26.53,89.35 C3.2 28.08,89.3 28.13,89.35
  Top 0.406: U6.1_GND 11.09,102.92 11.06,102.89 | 12.33,120.13 18.37,120.13 GNSS.G@2 | 11.06,109.65 11.25,109.65 v19.22,109.65 21.92,109.65 | v25.57,109.65 24.08,109.65 | 24.08,109.65 21.92,109.65 | U6.12_GND 21.94,109.67 21.92,109.65 | U6.10_GND 24.09,109.66 24.08,109.65 | GND2.1 73.94,91 73.94,90.98 75.21,92.25 76.4,92.25 | 29.38,83.77 v30.27,83.77 30.27,89.35 | 67.07,96.19 54.68,96.19 54.35,96.52 | C19.2 27.67,67.71 27.63,67.74 | 43.76,70.15 43.76,67.68 44.1,67.34 44.1,61.47 44.49,61.07 | 67.1,102.03 64.81,102.03 R11.1 64.68,101.14 64.15,100.6 58.37,100.6 57.7,101.27 R2.1 | 28.11,79.2 28.11,80.5 29.44,81.83 C6.2 29.38,82.41 29.38,83.77 | C13.2 28.14,89.35 28.13,89.35 | RELAY1.7 48.52,116.63 D3.A | JP1.1 67.1,107.65 | U1.2 40.96,72.96 43.76,70.15 | R16.2 54.12,96.52 54.35,96.52 | 35.2,96.47 37.2,96.47 37.2,97.14 v37.38,97.14 37.92,97.14 | 38.37,92.95 37.19,92.95 | 37.92,98.43 37.92,97.14 | 37.92,97.14 37.92,95.78 | C16.2 47.95,102.67 v46.43,104.19 | D2.A 28.85,116.64 GNSS.G@3 | 70.98,96.19 76.4,96.19 76.4,92.25 | 70.98,96.19 67.07,96.19 | 76.4,92.25 76.4,83.75 | CON1.SPRT@2 45.9,0.75 49,0.75 49,55.65 48.94,55.65 | 11.06,86.54 15.34,86.54 15.64,86.24 18.67,86.24 21.14,83.77 29.38,83.77 | GND6.1 71,96.17 70.98,96.19 | 52.14,83.86 52.17,83.89 54,83.89 54.14,83.75 76.4,83.75
  Top 0.61: D2.A RELAY1.12
  Top 0.813: 49.38,100.28 49.38,101.74 | 49.38,101.74 C16.2 | C5.2 v40.75,92.92 38.4,92.92 | C12.- 49.86,101.74 49.38,101.74 | 76.4,74.48 67.18,74.48 GND.1 | 11.25,109.65 4.75,109.65 U53.P$1
  Bottom 0.406: v41.06,89.81 40.75,90.12 v40.75,92.92 | SW1.3 SW1.4 4.83,19.16 7.16,19.16 9.34,21.34 9.34,91.66 7.75,93.25 3,93.25 2.67,93.58 2.67,107.46 3.23,108.02 3.28,108 U53.P$1
  Bottom 0.61: GNSS.G@3 GNSS.G@2 19.22,118.65 v19.22,109.65 | GNSS.G@3 31.27,118.97 33.6,116.63 RELAY1.12 35.63,114.73 44.52,114.73 RELAY1.7 | v25.57,109.65 25.57,118.01 GNSS.G@3
  pour Bottom (isolate 0.305, rank 2, hatched): 0.58,0.7 0.58,121 77.39,121 77.39,0.7
  pour Top (isolate 0.305, rank 2, hatched): 0.58,0.7 0.58,121 77.39,121 77.39,0.7
  pour Top (isolate 0.102): 10.33,121 29.38,121 29.38,113.46 28.74,113.46 28.74,100.76 10.33,100.76
  pour Bottom (isolate 0.102): 16.68,121 29.38,121 29.38,108.38 16.68,108.38
GNDA  (via drill 0.25)
  other vias: 50.97,113.46 59.86,113.46
  pour Bottom (isolate 0.102): 49.83,121 60.75,121 60.75,112.19 49.83,112.19
  pour Top (isolate 0.102): 49.83,121 60.75,121 60.75,112.19 49.83,112.19
GPS_ANT
  Top 0.406: 23.06,112.44 U6.11_RF_IN
  Top 0.813: 23.06,112.44 L1.2 23.04,115.03 23.04,117.88 23.03,117.9 GNSS.1
LTC3225_VOUT
  Top 0.203: 47.36,99 U3.10
  Top 0.305: R15.1 44.17,94.38 Q4.2
  Top 0.61: Q4.2 44.37,95.92 44.37,99
  Top 0.813: C11.+ 40.33,100.35 41.68,99 44.37,99 46.25,99 | 46.25,99 46.26,99.01 C16.1 | 47.36,99 46.25,99
MISO  (via drill 0.25 pad 0.46)
  Top 0.203: U5.21 39.56,90.78 40.16,91.38 v46.02,91.38
  Top 0.305: v49.95,91.42 50.75,90.63 60.62,90.63 MISO.1
  Bottom 0.203: v49.95,91.42 49.9,91.38 v46.02,91.38
MOSI  (via drill 0.25 pad 0.46)
  Top 0.203: U5.19 40.56,89.46 40.49,89.58 40.49,90 41.11,90.61 45.4,90.61 v45.76,90.25
  Top 0.305: v48.68,90.25 49.61,89.33 63.98,89.33 67.31,86 MOSI.1
  Bottom 0.203: v45.76,90.25 45.78,90.23 48.66,90.23 v48.68,90.25
N$1
  Top 0.406: L1.1 R9.1 19.28,115.81 18.81,116.29 15.54,116.29 C18.1
N$2
  Top 0.813: CON4.3 55.22,118.85 IRIDIUM.1
N$3
  Top 0.406: R10.2 39.89,65.14 LED2.A
N$5
  Top 0.203: U5.1 46.17,82.55 X1.P$1
  Top 0.406: X1.P$1 47.29,81.56 47.29,81.49 C2.1
N$6  (via drill 0.25 pad 0.46)
  Top 0.203: U3.3 49.38,96.22 49.58,96.03 49.58,93.68 v49.64,93.62
  Top 0.813: C12.+ C11.-
  Bottom 0.406: v49.64,93.62 49.64,104.35 50.49,105.2 C12.+
N$7
  Top 0.203: U5.2 46.25,83.05 X1.P$2
  Top 0.406: X1.P$2 49.42,83.96 C4.1
N$8
  Bottom 0.813: BAT1.GND@1 BAT1.GND@2 BAT2.PWR@2 BAT2.PWR@1
N$9
  Top 0.203: U3.2 48.87,95.17 C15.2
N$10
  Top 0.203: U3.1 48.39,96.33 C15.1
N$11
  Top 0.203: U3.7 49.89,99.62 50.33,100.06
  Top 0.406: 50.33,100.06 51.13,100.86 53.92,100.86 58.65,105.59 60.78,105.59 61.19,105.17 JP2.2
N$12
  Top 0.406: U4.2 25.41,88.1 26.24,87.27 C13.1
N$13  (via drill 0.25 pad 0.61)
  Top 0.305: U3.6 51.15,99 v51.7,99.55
  Top 0.406: JP1.2 61.22,107.62 61.22,106.95 60.46,106.19 58.02,106.19 53.64,101.81 v53.16,101.81
  Bottom 0.406: v51.7,99.55 51.7,100.35 v53.16,101.81
N$15  (via drill 0.25 pad 0.81)
  Top 0.813: v10.7,57.19 25.32,57.19 v27.08,58.95
  Bottom 0.813: BAT3.GND@1 BAT3.GND@2 52.25,63.77 46.5,58.02 39.55,58.02 38.1,59.47 27.6,59.47 v27.08,58.95 | BAT6.GND@2 BAT6.GND@1 67.25,11.57 67.25,63.77 BAT3.GND@1 | U53.P$2 10.11,98.83 10.11,57.78 v10.7,57.19 | BAT-.1 66.69,66.98 BAT3.GND@1
N$16
  Top 0.406: CON1.VBUS 41.85,62.37 D4.A
N$17
  Top 0.406: JP2.3 59.67,101.97 R2.2
N$18
  Top 0.406: R11.2 62.72,101.97 JP2.1
N$19  (via drill 0.25, 0.25 pad 0.46)
  Top 0.305: v39.95,93.9 40.27,94.22 R15.2 42.27,94.26 Q4.1 | v43.41,71.52 43.41,73.05 Q5.C
  Bottom 0.203: 36.17,79.74 36.17,80.82 34.9,82.09 34.9,84.01 36.94,86.04 36.94,90 37.25,90.31 38.81,90.31 39.89,91.39 39.89,93.84 v39.95,93.9
  Bottom 0.305: 36.17,79.74 36.17,72.85 37.98,71.04 42.94,71.04 v43.41,71.52
N$20
  Top 0.305: Q5.B 44.33,76.37 44.75,76.79 R14.2
N$21
  Bottom 0.813: BAT2.GND@2 BAT2.GND@1 BAT3.PWR@1 BAT3.PWR@2
N$22
  Bottom 0.813: BAT5.PWR@2 BAT5.PWR@1 BAT4.GND@1 BAT4.GND@2
N$23
  Top 0.813: RELAY1.3 38.81,112.6 38.59,112.83 37,112.83 35.22,114.6 35.22,117.27 NC1.1
N$24
  Top 0.813: RELAY1.4 41.35,113.21 40.59,113.97 37.48,113.97 36.33,115.11 36.33,118.86 COM1.1
N$25
  Top 0.813: RELAY1.5 43.89,114.32 43.1,115.11 38.02,115.11 37.38,115.71 37.38,117.56 38.27,118.41 NO1.1
N$26
  Top 0.813: RELAY1.8 45.89,118.63 NO2.1
N$27
  Top 0.813: RELAY1.9 43.35,118.63 COM2.1
N$28
  Top 0.813: RELAY1.10 40.81,118.63 NC2.1
N$29
  Bottom 0.813: BAT5.GND@1 BAT5.GND@2 BAT6.PWR@2 BAT6.PWR@1
RESET_RELAY
  Top 0.61: D3.C 47.85,112.97 RELAY1.6 45.92,111.56 44.02,109.65 38.27,109.65 36.87,108.25 Q3.3
SCK  (via drill 0.25 pad 0.46)
  Top 0.203: U5.20 40.06,90.33 40.71,90.98 45.63,90.98 46.05,90.79 v46.5,90.79
  Top 0.305: v49.32,90.82 50.21,89.93 68.6,89.93 70.03,88.5 70.17,88.5 SCK.1
  Bottom 0.203: v49.32,90.82 49.29,90.79 v46.5,90.79
SCL  (via drill 0.25 pad 0.46, 0.25 pad 0.61)
  Top 0.203: U5.32 34.58,84.55 v34.4,84.73
  Top 0.305: R8.2 21.38,84.89 21.16,85.1 21.16,85.87 | 21.16,85.87 U4.8 | v24.94,86.88 24.94,86.41 24.4,85.87 21.16,85.87
  Top 0.406: SCL.1 15.86,86.85 U4.8
  Bottom 0.305: v34.4,84.73 32.27,86.85 v24.94,86.88
SD_CS  (via drill 0.25 pad 0.46)
  Top 0.203: v45.01,88.61 44.84,88.77 U5.13
  Top 0.305: v48.18,88.6 55.92,88.6 56.84,87.68 62.03,87.68 CS.1
  Bottom 0.203: v45.01,88.61 45.01,88.58 48.16,88.58 v48.18,88.6
SDA  (via drill 0.25 pad 0.46, 0.25 pad 0.61)
  Top 0.203: U5.31 35.47,85.05 v35.09,85.42
  Top 0.305: R5.2 29.41,86.16 v29.41,88.1
  Top 0.406: U4.7 v19.98,88.1 17.58,88.09 17.19,88.09 SDA.1
  Bottom 0.305: v35.09,85.42 32.42,88.1 v29.41,88.1 v19.98,88.1
SET_RELAY
  Top 0.61: RELAY1.1 32.34,112.94 D2.C 31.47,112.9 Q2.3
SWCLK  (via drill 0.25 pad 0.46)
  Top 0.203: v42.08,80.34 42.08,81.8 U5.45
  Bottom 0.305: SWCLK.1 61.42,74.18 53.93,74.18 53.23,74.88 47.49,74.88 42.08,80.28 v42.08,80.34
SWDIO  (via drill 0.25 pad 0.46)
  Top 0.203: v42.84,80.34 42.84,80.73 42.59,80.98 42.59,81.8 U5.46
  Bottom 0.305: SWDIO.1 62.41,75.73 59.41,75.73 58.34,74.66 54.21,74.66 53.51,75.36 47.83,75.36 v42.84,80.34
VBAT  (via drill 0.25 pad 0.81)
  Top 0.813: v27.82,105.59 29.44,105.59 D1.A
  Bottom 0.813: v27.82,105.59 26.84,104.6 26.84,100.16 25.25,98.57 BAT1.PWR@2 BAT1.PWR@1
VBAT1  (via drill 0.25 pad 0.81)
  Top 0.813: D5.A 27.95,103.82 v27.85,103.72
  Bottom 0.813: BAT4.PWR@1 BAT4.PWR@2 23.68,47.72 23.68,53.8 19.65,57.83 12.73,57.83 11.33,59.23 11.33,92.17 12.3,93.14 20.51,93.14 24.86,97.49 25.64,97.49 27.85,99.7 v27.85,103.72
VBUS  (via drill 0.25, 0.25 pad 0.61, 0.25 pad 0.81)
  Top 0.203: U3.9 48.87,99.39 v48.11,100.16
  Top 0.305: R3.2 46.34,77.26 47.13,76.47
  Top 0.406: U2.1 26.14,80.15 25.85,80.15 25.51,79.81 25.51,78.53 25.79,78.25 U2.3 | R7.1 45.45,69.35 v45.45,70.19 | D4.C v41.83,67.36 | JP1.3 v59.67,110.06
  Top 0.61: 26.14,80.15 v26.14,82.31 27.51,82.31 C6.1 | v50.37,67.2 54.06,67.2 55.86,69 55.86,70.34 56.97,71.45 VBUS.1
  Top 0.813: D1.C v35,105.62 34.82,105.44 34.82,104.97 33.67,103.82 D5.C | v48.24,77 47.65,77 47.13,76.47 45.45,74.79 v45.45,74.09 | C17.1 46.18,108.13 v46.05,108
  Bottom 0.406: v50.37,67.2 42.9,67.2 42.74,67.36 v41.83,67.36
  Bottom 0.813: v26.14,82.31 29.13,82.31 30.87,80.57 30.87,71.33 32.02,70.19 42.3,70.19 | 47.99,108 48.14,107.84 48.11,107.81 v48.11,100.16 | 47.99,108 v46.05,108 37.38,108 v35,105.62 | 42.3,70.19 v45.45,70.19 v45.45,74.09 | 42.3,70.19 42.28,68.69 42.31,68.66 42.31,67.84 v41.83,67.36 | 47.99,108 52.27,108 | 52.27,108 52.27,102.28 50.62,100.63 50.62,96.84 52.4,95.06 52.4,90.47 48.24,86.31 v48.24,77 | 52.27,108 57.61,108 v59.67,110.06
VCC_RF
  Top 0.406: R9.2 18.27,114.13 18.27,113.97 18.43,113.81 19.31,113.81 19.74,113.38 U6.14_VCC_RF
VDDCORE1
  Top 0.152: U5.43 41.06,81.62 41.05,81.61
  Top 0.203: 41.05,81.61 41.05,80.16 41.66,79.56 C1.1

### Text on the board
Top: TOP
Bottom: BOTTOM
tPlace: 5.3 / V | 4.8V | U6 | 150 | + | + | mA | 60mA | Iridium 9603N / Beacon V5M
bPlace: 5.5V MAX | 30VDC 2A / MAX | + | - | + | - | Please return to: | Iridium 9603N / Beacon V5M
tNames: GND
bNames: GND